# EAGLE design MusselTracker2_RevC (EAGLE 7.2.0)
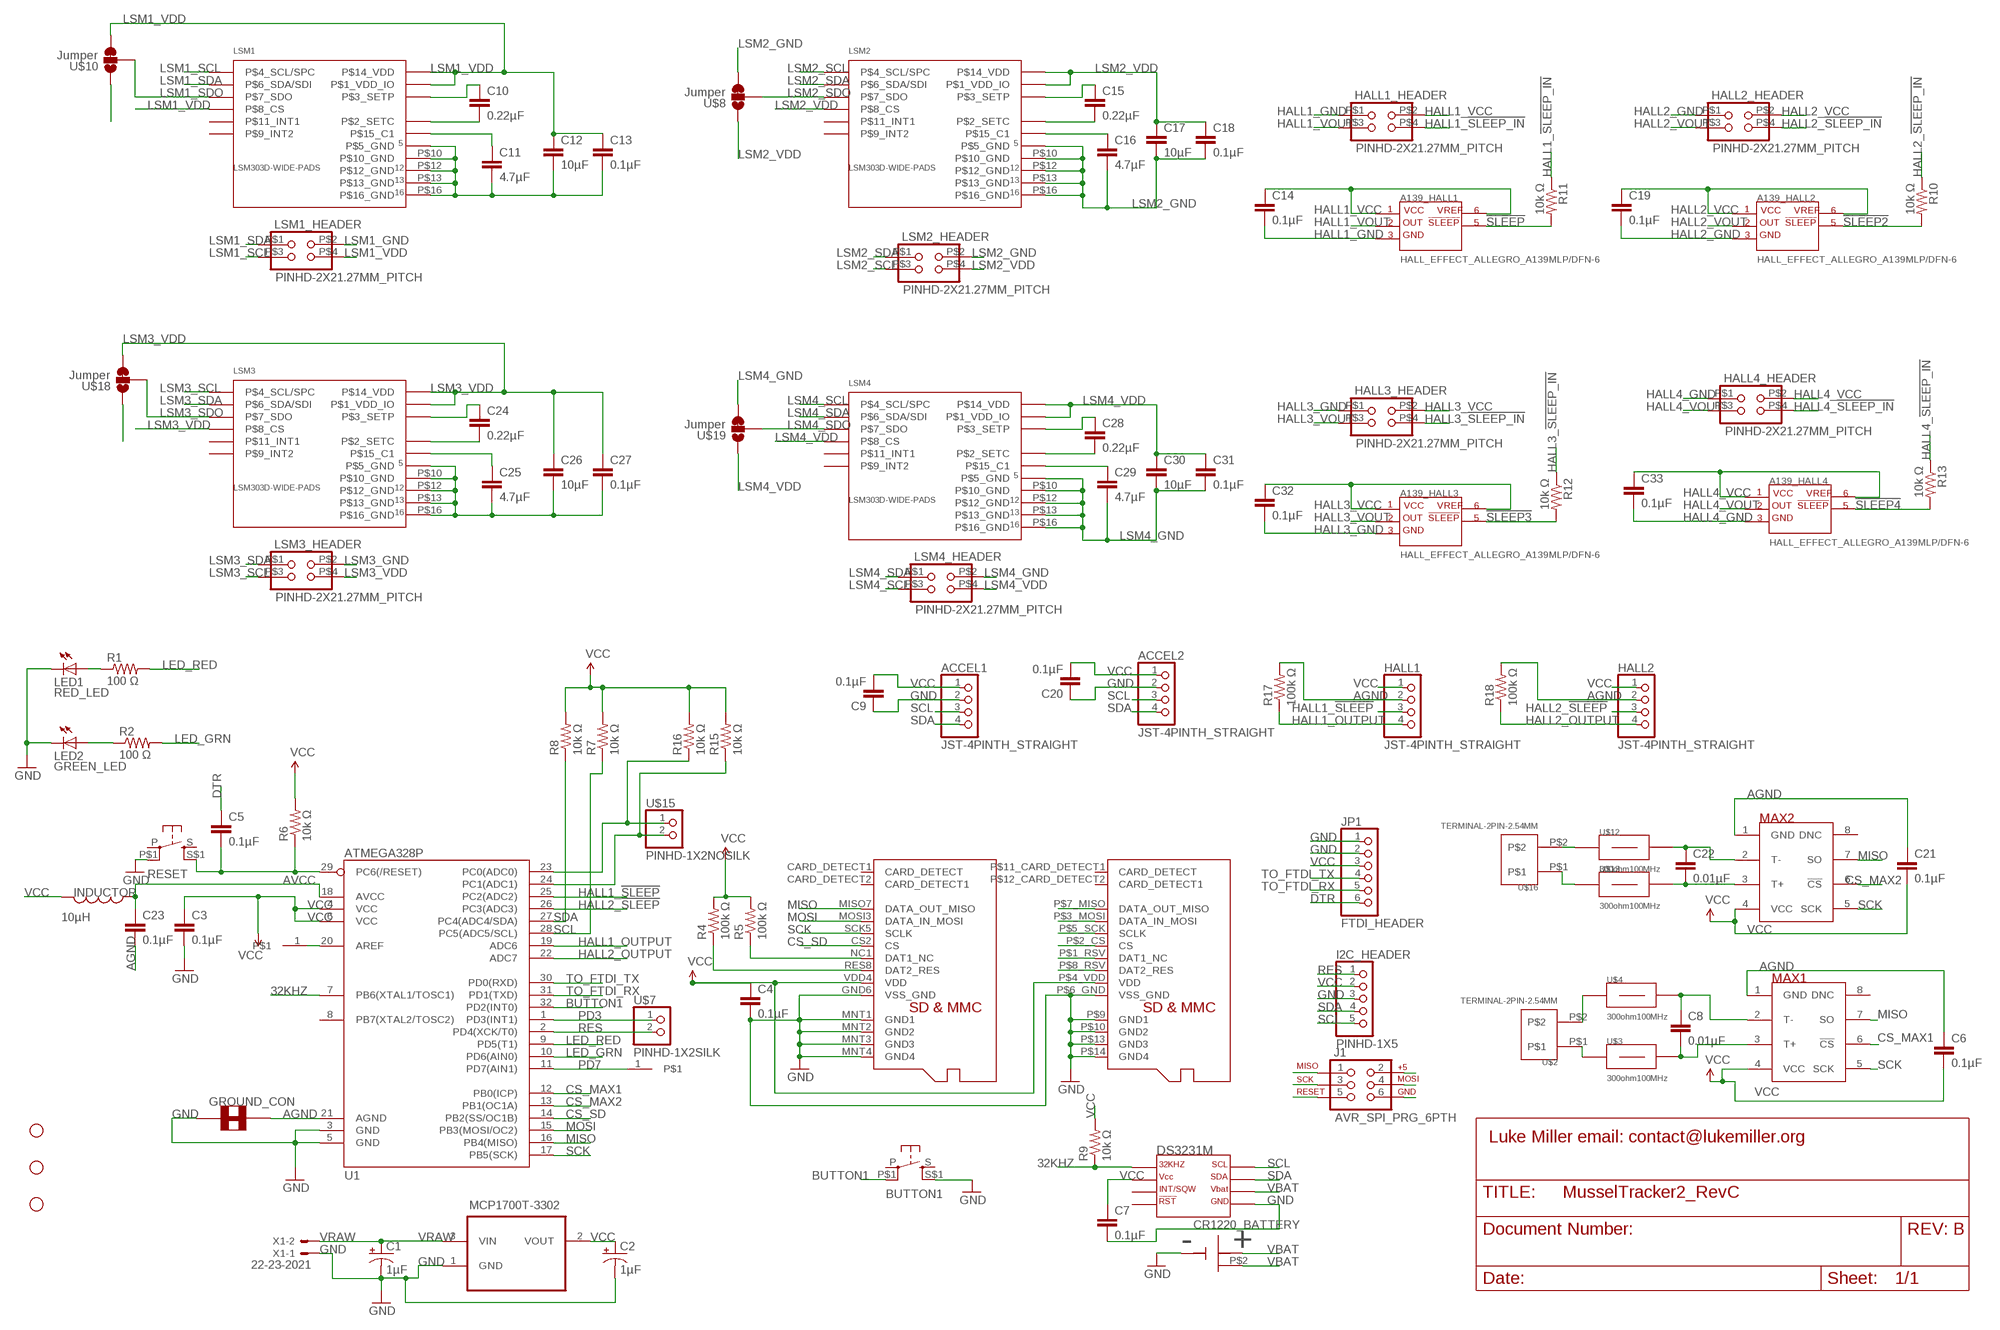
[diagram p0: schematic, sheet 1]

## Parts
A139_HALL1  HALL_EFFECT_ALLEGRO_A139MLP/DFN-6  [A139*_HALL_EFFECT]
A139_HALL2  HALL_EFFECT_ALLEGRO_A139MLP/DFN-6  [A139*_HALL_EFFECT]
A139_HALL3  HALL_EFFECT_ALLEGRO_A139MLP/DFN-6  [A139*_HALL_EFFECT]
A139_HALL4  HALL_EFFECT_ALLEGRO_A139MLP/DFN-6  [A139*_HALL_EFFECT]
ACCEL1  JST-4PINTH_STRAIGHT  [JST-PH-4-THM]
ACCEL2  JST-4PINTH_STRAIGHT  [JST-PH-4-THM]
BUTTON1  PUSHBUTTON_DPST_SMD  [PUSHBUTTON_DPST_SMD]
C1  1µF  CPOL-USB  [PANASONIC_B]
C2  1µF  CPOL-USB  [PANASONIC_B]
C3  0.1µF  CAP0805  [0805]
C4  0.1µF  CAP0805  [0805]
C5  0.1µF  CAP0805  [0805]
C6  0.1µF  CAP0805  [0805]
C7  0.1µF  CAP0805  [0805]
C8  0.01µF  CAP0805_KEMET  [0805_CAP_50V_KEMET]
C9  0.1µF  CAP0805  [0805]
C10  0.22µF  CAP0805  [0805]
C11  4.7µF  CAP0805  [0805]
C12  10µF  CAP0805  [0805]
C13  0.1µF  CAP0805  [0805]
C14  0.1µF  CAP0805  [0805]
C15  0.22µF  CAP0805  [0805]
C16  4.7µF  CAP0805  [0805]
C17  10µF  CAP0805  [0805]
C18  0.1µF  CAP0805  [0805]
C19  0.1µF  CAP0805  [0805]
C20  0.1µF  CAP0805  [0805]
C21  0.1µF  CAP0805  [0805]
C22  0.01µF  CAP0805_KEMET  [0805_CAP_50V_KEMET]
C23  0.1µF  CAP0805  [0805]
C24  0.22µF  CAP0805  [0805]
C25  4.7µF  CAP0805  [0805]
C26  10µF  CAP0805  [0805]
C27  0.1µF  CAP0805  [0805]
C28  0.22µF  CAP0805  [0805]
C29  4.7µF  CAP0805  [0805]
C30  10µF  CAP0805  [0805]
C31  0.1µF  CAP0805  [0805]
C32  0.1µF  CAP0805  [0805]
C33  0.1µF  CAP0805  [0805]
CR1220_BATTERY  CR1220_BATTERY_HOLDERSMD  [CR1220_BATTERY_HOLDER_SMD]
DS3231M  DS3231MSOIC-8  [DS3231M_SOIC8]
GROUND_CON  SOLDER_JUMPER_TRACESTANDARD  [SJ_2S-TRACE]
HALL1  JST-4PINTH_STRAIGHT  [JST-PH-4-THM]
HALL1_HEADER  PINHD-2X21.27MM_PITCH  [2X2_1.27MM]
HALL2  JST-4PINTH_STRAIGHT  [JST-PH-4-THM]
HALL2_HEADER  PINHD-2X21.27MM_PITCH  [2X2_1.27MM]
HALL3_HEADER  PINHD-2X21.27MM_PITCH  [2X2_1.27MM]
HALL4_HEADER  PINHD-2X21.27MM_PITCH  [2X2_1.27MM]
I2C_HEADER  PINHD-1X5  [1X05_BIGLOCK]
INDUCTOR  10µH  INDUCTOR0805_TY  [I_0805]
J1  AVR_SPI_PRG_6PTH  [2X3]
JP1  FTDI_HEADER  PINHD-1X6LOCK  [1X06-BIGLOCK]
LED1  RED_LED  LED0805  [CHIPLED_0805]
LED2  GREEN_LED  LED0805  [CHIPLED_0805]
LSM1  LSM303D-WIDE-PADS  [LSM303D]
LSM1_HEADER  PINHD-2X21.27MM_PITCH  [2X2_1.27MM]
LSM2  LSM303D-WIDE-PADS  [LSM303D]
LSM2_HEADER  PINHD-2X21.27MM_PITCH  [2X2_1.27MM]
LSM3  LSM303D-WIDE-PADS  [LSM303D]
LSM3_HEADER  PINHD-2X21.27MM_PITCH  [2X2_1.27MM]
LSM4  LSM303D-WIDE-PADS  [LSM303D]
LSM4_HEADER  PINHD-2X21.27MM_PITCH  [2X2_1.27MM]
MAX1  MAX31855  [SO08]
MAX2  MAX31855  [SO08]
MCP1700T-3302  MCP1700T-3302E/TT  [SOT95P237X112-3N]
R1  100 Ω  RESISTOR_SMDR0805  [R0805]
R2  100 Ω  RESISTOR_SMDR0805  [R0805]
R4  100k Ω  RESISTOR_SMDR0805  [R0805]
R5  100k Ω  RESISTOR_SMDR0805  [R0805]
R6  10k Ω  RESISTOR_SMDR0805  [R0805]
R7  10k Ω  RESISTOR_SMDR0805  [R0805]
R8  10k Ω  RESISTOR_SMDR0805  [R0805]
R9  10k Ω  RESISTOR_SMDR0805  [R0805]
R10  10k Ω  RESISTOR_SMDR0805  [R0805]
R11  10k Ω  RESISTOR_SMDR0805  [R0805]
R12  10k Ω  RESISTOR_SMDR0805  [R0805]
R13  10k Ω  RESISTOR_SMDR0805  [R0805]
R15  10k Ω  RESISTOR_SMDR0805  [R0805]
R16  10k Ω  RESISTOR_SMDR0805  [R0805]
R17  100k Ω  RESISTOR_SMDR0805  [R0805]
R18  100k Ω  RESISTOR_SMDR0805  [R0805]
RESET  PUSHBUTTON_DPST_SMD  [PUSHBUTTON_DPST_SMD]
STANDOFF1  STAND-OFF  [STAND-OFF]
STANDOFF2  STAND-OFF  [STAND-OFF]
STANDOFF3  STAND-OFF  [STAND-OFF]
U1  ATMEGA328P  ATMEGA328_SMT  [TQFP32-08]
U$1  MICROSD_MOLEX_REVERSECURRENT  [MICROSD_SOCKET_MOLEX_REVERSEMOUNT]
U$2  TERMINAL-2PIN-2.54MM  [TERMINAL-2PIN-2.54MM]
U$3  300ohm100MHz  FERRITE_BEAD0805  [0805]
U$4  300ohm100MHz  FERRITE_BEAD0805  [0805]
U$6  PINHD-1X1SMALL  [1X01_SMALL]
U$7  PINHD-1X2SILK  [1X02]
U$8  Jumper  SOLDER_JUMPER_3_2OF3_NORMALLY_CLOSED_BY_TRACESMALL  [PAD-JUMPER-3-2OF3_NC_BY_TRACE_SMALL]
U$10  Jumper  SOLDER_JUMPER_3_2OF3_NORMALLY_CLOSED_BY_TRACESMALL  [PAD-JUMPER-3-2OF3_NC_BY_TRACE_SMALL]
U$12  300ohm100MHz  FERRITE_BEAD0805  [0805]
U$13  300ohm100MHz  FERRITE_BEAD0805  [0805]
U$14  MICROSD_MOLEX_REVERSEOBSOLETE  [MICROSD_SOCKET_MOLEX_REVERSEMOUNT_OBSOLETE]
U$15  PINHD-1X2NOSILK  [1X02_NOSILK]
U$16  TERMINAL-2PIN-2.54MM  [TERMINAL-2PIN-2.54MM]
U$17  PINHD-1X1SMALL  [1X01_SMALL]
U$18  Jumper  SOLDER_JUMPER_3_2OF3_NORMALLY_CLOSED_BY_TRACESMALL  [PAD-JUMPER-3-2OF3_NC_BY_TRACE_SMALL]
U$19  Jumper  SOLDER_JUMPER_3_2OF3_NORMALLY_CLOSED_BY_TRACESMALL  [PAD-JUMPER-3-2OF3_NC_BY_TRACE_SMALL]
X1  22-23-2021  [22-23-2021]

## Nets
32KHZ: DS3231M.1(P$1_32KHZ) R9.1 U1.7(PB6(XTAL1/TOSC1))
!SLEEP: A139_HALL1.P$5 R11.2
!SLEEP2: A139_HALL2.P$5 R10.2
!SLEEP3: A139_HALL3.P$5 R12.2
!SLEEP4: A139_HALL4.P$5 R13.2
AGND: C6.1 C21.1 C23.2 GROUND_CON.2 HALL1.2 HALL2.2 MAX1.1(GND) MAX2.1(GND) R17.2 R18.2 U1.21(AGND)
AVCC: C23.1 INDUCTOR.P$1 U1.18(AVCC)
BUTTON1: BUTTON1.P$1(P1) U1.32(PD2(INT0))
CS_MAX1: MAX1.6(!CS) U1.12(PB0(ICP))
CS_MAX2: MAX2.6(!CS) U1.13(PB1(OC1A))
CS_SD: U1.14(PB2(SS/OC1B)) U$1.CS2(CS) U$14.P$2_CS(CS)
DTR: C5.1 JP1.6
GND: ACCEL1.2 ACCEL2.2 BUTTON1.S$1(S1) C1.- C2.- C3.2 C4.2 C7.2 C9.1 C20.1 CR1220_BATTERY.GND DS3231M.5(P$5_GND) GROUND_CON.1 I2C_HEADER.3 J1.6 JP1.1 JP1.2 LED1.C LED2.C MCP1700T-3302.1(GND) RESET.P$1(P1) U1.3(GND) U1.5(GND) U$1.GND6(VSS_GND) U$1.MNT1(GND1) U$1.MNT2(GND2) U$1.MNT3(GND3) U$1.MNT4(GND4) U$14.P$6_GND(VSS_GND) U$14.P$9(GND1) U$14.P$10(GND2) U$14.P$13(GND3) U$14.P$14(GND4) X1.1
HALL1_!SLEEP: HALL1.3 U1.25(PC2(ADC2))
HALL1_!SLEEP_IN: HALL1_HEADER.P$4 R11.1
HALL1_GND: A139_HALL1.P$3_4 C14.2 HALL1_HEADER.P$1
HALL1_OUTPUT: HALL1.4 R17.1 U1.19(ADC6)
HALL1_VCC: A139_HALL1.P$1 A139_HALL1.P$6 C14.1 HALL1_HEADER.P$2
HALL1_VOUT: A139_HALL1.P$2 HALL1_HEADER.P$3
HALL2_!SLEEP: HALL2.3 U1.26(PC3(ADC3))
HALL2_!SLEEP_IN: HALL2_HEADER.P$4 R10.1
HALL2_GND: A139_HALL2.P$3_4 C19.2 HALL2_HEADER.P$1
HALL2_OUTPUT: HALL2.4 R18.1 U1.22(ADC7)
HALL2_VCC: A139_HALL2.P$1 A139_HALL2.P$6 C19.1 HALL2_HEADER.P$2
HALL2_VOUT: A139_HALL2.P$2 HALL2_HEADER.P$3
HALL3_!SLEEP_IN: HALL3_HEADER.P$4 R12.1
HALL3_GND: A139_HALL3.P$3_4 C32.2 HALL3_HEADER.P$1
HALL3_VCC: A139_HALL3.P$1 A139_HALL3.P$6 C32.1 HALL3_HEADER.P$2
HALL3_VOUT: A139_HALL3.P$2 HALL3_HEADER.P$3
HALL4_!SLEEP_IN: HALL4_HEADER.P$4 R13.1
HALL4_GND: A139_HALL4.P$3_4 C33.2 HALL4_HEADER.P$1
HALL4_VCC: A139_HALL4.P$1 A139_HALL4.P$6 C33.1 HALL4_HEADER.P$2
HALL4_VOUT: A139_HALL4.P$2 HALL4_HEADER.P$3
LED_GRN: R2.2 U1.10(PD6(AIN0))
LED_RED: R1.2 U1.9(PD5(T1))
LSM1_GND: C11.2 C12.2 C13.2 LSM1.P$5(P$5_GND) LSM1.P$10(P$10_GND) LSM1.P$12(P$12_GND) LSM1.P$13(P$13_GND) LSM1.P$16(P$16_GND) LSM1_HEADER.P$2 U$10.1
LSM1_SCL: LSM1.P$4(P$4_SCL/SPC) LSM1_HEADER.P$3
LSM1_SDA: LSM1.P$6(P$6_SDA/SDI) LSM1_HEADER.P$1
LSM1_SDO: LSM1.P$7(P$7_SDO) U$10.2
LSM1_VDD: C12.1 C13.1 LSM1.P$1(P$1_VDD_IO) LSM1.P$8(P$8_CS) LSM1.P$14(P$14_VDD) LSM1_HEADER.P$4 U$10.3
LSM2_GND: C16.2 C17.2 C18.2 LSM2.P$5(P$5_GND) LSM2.P$10(P$10_GND) LSM2.P$12(P$12_GND) LSM2.P$13(P$13_GND) LSM2.P$16(P$16_GND) LSM2_HEADER.P$2 U$8.3
LSM2_SCL: LSM2.P$4(P$4_SCL/SPC) LSM2_HEADER.P$3
LSM2_SDA: LSM2.P$6(P$6_SDA/SDI) LSM2_HEADER.P$1
LSM2_SDO: LSM2.P$7(P$7_SDO) U$8.2
LSM2_VDD: C17.1 C18.1 LSM2.P$1(P$1_VDD_IO) LSM2.P$8(P$8_CS) LSM2.P$14(P$14_VDD) LSM2_HEADER.P$4 U$8.1
LSM3_GND: C25.2 C26.2 C27.2 LSM3.P$5(P$5_GND) LSM3.P$10(P$10_GND) LSM3.P$12(P$12_GND) LSM3.P$13(P$13_GND) LSM3.P$16(P$16_GND) LSM3_HEADER.P$2 U$18.1
LSM3_SCL: LSM3.P$4(P$4_SCL/SPC) LSM3_HEADER.P$3
LSM3_SDA: LSM3.P$6(P$6_SDA/SDI) LSM3_HEADER.P$1
LSM3_SDO: LSM3.P$7(P$7_SDO) U$18.2
LSM3_VDD: C26.1 C27.1 LSM3.P$1(P$1_VDD_IO) LSM3.P$8(P$8_CS) LSM3.P$14(P$14_VDD) LSM3_HEADER.P$4 U$18.3
LSM4_GND: C29.2 C30.2 C31.2 LSM4.P$5(P$5_GND) LSM4.P$10(P$10_GND) LSM4.P$12(P$12_GND) LSM4.P$13(P$13_GND) LSM4.P$16(P$16_GND) LSM4_HEADER.P$2 U$19.3
LSM4_SCL: LSM4.P$4(P$4_SCL/SPC) LSM4_HEADER.P$3
LSM4_SDA: LSM4.P$6(P$6_SDA/SDI) LSM4_HEADER.P$1
LSM4_SDO: LSM4.P$7(P$7_SDO) U$19.2
LSM4_VDD: C30.1 C31.1 LSM4.P$1(P$1_VDD_IO) LSM4.P$8(P$8_CS) LSM4.P$14(P$14_VDD) LSM4_HEADER.P$4 U$19.1
MISO: J1.1 MAX1.7(SO) MAX2.7(SO) U1.16(PB4(MISO)) U$1.MISO7(DATA_OUT_MISO) U$14.P$7_MISO(DATA_OUT_MISO)
MOSI: J1.4 U1.15(PB3(MOSI/OC2)) U$1.MOSI3(DATA_IN_MOSI) U$14.P$3_MOSI(DATA_IN_MOSI)
N$1: U$2.P$2 U$4.1
N$2: LED1.A R1.1
N$3: U$2.P$1 U$3.1
N$4: C11.1 LSM1.P$15(P$15_C1)
N$5: C10.2 LSM1.P$2(P$2_SETC)
N$6: R16.1 U1.23(PC0(ADC0)) U$15.1
N$7: U1.20(AREF) U$17.1
N$9: R15.1 U1.24(PC1(ADC1)) U$15.2
N$10: LED2.A R2.1
N$11: U$12.1 U$16.P$2
N$12: U$13.1 U$16.P$1
N$14: C24.2 LSM3.P$2(P$2_SETC)
N$15: C24.1 LSM3.P$3(P$3_SETP)
N$17: C10.1 LSM1.P$3(P$3_SETP)
N$18: C15.2 LSM2.P$2(P$2_SETC)
N$19: C15.1 LSM2.P$3(P$3_SETP)
N$20: C16.1 LSM2.P$15(P$15_C1)
N$21: C25.1 LSM3.P$15(P$15_C1)
N$22: C28.1 LSM4.P$3(P$3_SETP)
N$23: C28.2 LSM4.P$2(P$2_SETC)
N$24: C29.1 LSM4.P$15(P$15_C1)
NC1: R5.1 U$1.NC1(DAT1_NC) U$14.P$1_RSV(DAT1_NC)
PD3: U1.1(PD3(INT1)) U$7.1
PD7: U1.11(PD7(AIN1)) U$6.1
RES: I2C_HEADER.1 U1.2(PD4(XCK/T0)) U$7.2
RES8: R4.1 U$1.RES8(DAT2_RES) U$14.P$8_RSV(DAT2_RES)
RESET: C5.2 J1.5 R6.1 RESET.S$1(S1) U1.29(PC6(/RESET))
SCK: J1.3 MAX1.5(SCK) MAX2.5(SCK) U1.17(PB5(SCK)) U$1.SCK5(SCLK) U$14.P$5_SCK(SCLK)
SCL: ACCEL1.3 ACCEL2.3 DS3231M.8(P$8_SCL) I2C_HEADER.5 R7.1 U1.28(PC5(ADC5/SCL))
SDA: ACCEL1.4 ACCEL2.4 DS3231M.7(P$7_SDA) I2C_HEADER.4 R8.1 U1.27(PC4(ADC4/SDA))
T+_MAX1: C8.2 MAX1.3(T+) U$3.2
T+_MAX2: C22.2 MAX2.3(T+) U$13.2
T-_MAX1: C8.1 MAX1.2(T-) U$4.2
T-_MAX2: C22.1 MAX2.2(T-) U$12.2
TO_FTDI_RX: JP1.5 U1.31(PD1(TXD))
TO_FTDI_TX: JP1.4 U1.30(PD0(RXD))
VBAT: CR1220_BATTERY.P$1(VBAT) CR1220_BATTERY.P$2 DS3231M.6(P$6_VBAT)
VCC: ACCEL1.1 ACCEL2.1 C2.+ C3.1 C4.1 C6.2 C7.1 C9.2 C20.2 C21.2 DS3231M.2(P$2_VCC) HALL1.1 HALL2.1 I2C_HEADER.2 INDUCTOR.P$2 J1.2 JP1.3 MAX1.4(VCC) MAX2.4(VCC) MCP1700T-3302.2(VOUT) R4.2 R5.2 R6.2 R7.2 R8.2 R9.2 R15.2 R16.2 U1.4(VCC) U1.6(VCC) U$1.VDD4(VDD) U$14.P$4_VDD(VDD)
VRAW: C1.+ MCP1700T-3302.3(VIN) X1.2
Unconnected: BUTTON1.P BUTTON1.S DS3231M.3(P$3_INT) DS3231M.4(P$4_RST) LSM1.P$9(P$9_INT2) LSM1.P$11(P$11_INT1) LSM2.P$9(P$9_INT2) LSM2.P$11(P$11_INT1) LSM3.P$9(P$9_INT2) LSM3.P$11(P$11_INT1) LSM4.P$9(P$9_INT2) LSM4.P$11(P$11_INT1) MAX1.8(DNC) MAX2.8(DNC) RESET.P RESET.S U1.8(PB7(XTAL2/TOSC2)) U$1.CARD_DETECT1(CARD_DETECT) U$1.CARD_DETECT2(CARD_DETECT1) U$14.P$11_CARD_DETECT1(CARD_DETECT) U$14.P$12_CARD_DETECT2(CARD_DETECT1)

## Library data of the parts
A139_HALL1-A139_HALL4 = miller:HALL_EFFECT_ALLEGRO_A139*: Allegro A139* series Hall effect sensors A1391 1.25mV/Gauss A1392 2.5 mV/G A1393 5 mV/G A1395 10 mV/G Example Digikey PN 620-1031-1-ND (A1391SE)
ACCEL1 ACCEL2 HALL1 HALL2 = miller:JST-4PIN: JST PH series male header pins 2.0 mm pitch Example JST PN: B4B-PH-K-S(LF)(SN) Example Digikey PN: 455-1706-ND Mates with JST PN: PHR-4, Digikey PN: 455-1164-ND
BUTTON1 RESET = miller:PUSHBUTTON_DPST_SMD: PUSHBUTTON DPST SMD Omron B3S-1000 Digikey PN SW836CT-ND This is your standard "hobbyist" style momentary pushbutton in a surface mount package.
C1 C2 = miller:CPOL-US: POLARIZED CAPACITOR, American symbol
C3-C33 = miller:CAP: Capacitor Standard surface mount ceramic capacitor and 0.1" leaded capacitor.
CR1220_BATTERY = miller:CR1220_BATTERY_HOLDER: CR1220 Battery Holder Keystone Part # 3001 Digikey 3001K-ND
DS3231M = miller:DS3231M: DS3231M real time clock Battery backup, 2.3V to 5.5V supply voltage 1Hz and 32.768kHz outputs NOTE: This is a slightly lower cost version of the regular DS3231S, with fewer clock frequency output options and slightly lower long-term time accuracy. It uses the same I2C communications protocol as the DS3231S, and is available in a small SOIC-8 package or Wide SOIC-16 (0.300") package. Maxim PN DS3231MZ+ SOIC-8 package Maxim PN DS3231M+ SOIC-16 Wide package
GROUND_CON = miller:SOLDER_JUMPER_TRACE: Solder jumper with trace Treat this like a zero ohm resistor. The trace can be cut with a knife.
HALL1_HEADER HALL2_HEADER HALL3_HEADER HALL4_HEADER LSM1_HEADER LSM2_HEADER LSM3_HEADER LSM4_HEADER = miller:PINHD-2X2: 2x2 header Various pitches
I2C_HEADER = miller:PINHD-1X5: 1 x 5 header 0.1" spacing Slightly offset holes to help hold pins in place when soldering
INDUCTOR = Felicia_force_logger:INDUCTOR: Inductor Example: Taiyo Yuden PN LBR2012T100K
J1 = miller:AVR_SPI_PRG_6: AVR ISP 6 Pin This is the reduced ISP connector for AVR programming. Common on Arduino. This footprint will take up less PCB space and can be used with a 10-pin to 6-pin adapter such as SKU: BOB-08508 **Special note about "TEST_POINT" package. The stop mask is on the top side, so if you want your programming test points to be on the bottom of your board, make sure to place this package on the bottom side of the board. This also ensure that the orientation to program from the bottom side will be correct.
JP1 = miller:PINHD-1X6: PIN HEADER
LED1 LED2 = miller:LED: LEDs Standard schematic elements and footprints for 5mm, 3mm, 1206, and 0603 sized LEDs. 5mm - Spark Fun Electronics SKU : COM-00529 (and others)
LSM1-LSM4 = miller:LSM303D-WIDE-PADS: LSM303D magnetometer and accelerometer LGA-16 package with extra-wide pads
MAX1 MAX2 = miller:MAX31855: MAX31855 Thermocouple amplifier with cold junction compensation, SPI communication Maxim-ic PN MAX31855 (thermocouple code is appended at end of PN) Digikey PN MAX31855K, MAX31855T, MAX31855J etc. Surface mount, 8-SOIC Narrow, 3.0 to 3.6V supply
MCP1700T-3302 = miller:MCP1700T-3302E/TT: Low Quiescent Current LDO 3.3V Microchip Technology PN MCP1700T-3302E Digikey PN MCP1700T3302ETTCT-ND; MPN: MCP1700T-3302E/TT; OC_FARNELL: 1296592; OC_NEWARK: 88H9817; PACKAGE: SOT23-3; SUPPLIER: Microchip
R1 R2 R4-R13 R15-R18 = miller:RESISTOR_SMD: RESISTOR, American symbol
STANDOFF1-STANDOFF3 = miller:STAND-OFF: #4 Stand Off This is the mechanical footprint for a #4 phillips button head screw. Use the keepout ring to avoid running the screw head into surrounding components. SKU : PRT-00447
U1 = miller:ATMEGA328_SMT: 32-Pin Atmega328
U$1 U$14 = miller:MICROSD_MOLEX_REVERSE: Molex micro SD connector, push-push spring loaded, "reverse" mount Pins accessible at rear of case. Active: Molex PN 5027740891 Digikey PN WM24066CT-ND Obsolete: Molex PN 49225-201
U$2 U$16 = miller:TERMINAL-2PIN-2.54MM: Terminal block 0.1" spacing Example: On Shore Technology PN OSTVN02A150 Digikey PN ED10561-ND
U$3 U$4 U$12 U$13 = miller:FERRITE_BEAD: Ferrite bead Example: TDK Corp PN MMZ2012R301AT000, Digikey PN 445-2191-1-ND
U$6 U$17 = miller:PINHD-1X1: Just a single pin header, useful for making test point or stand-alone header hole. The small footprint is 0.035" diameter, barely large enough for standard 0.1" pitch header pins.
U$7 U$15 = miller:PINHD-1X2: 1x2 pin header 0.1" spacing (2.54mm)
U$8 U$10 U$18 U$19 = miller:SOLDER_JUMPER_3_2OF3_NORMALLY_CLOSED_BY_TRACE: Solder jumper pads, 3 position, 2 normally closed by trace Cut trace with a razor and bridge pads with solder if needed.
X1 = miller:22-23-2021: Molex KK series .100" (2.54mm) Center Header - 2 Pin; MF: MOLEX; MPN: 22-23-2021; OC_FARNELL: 1462926; OC_NEWARK: 25C3832

## Board
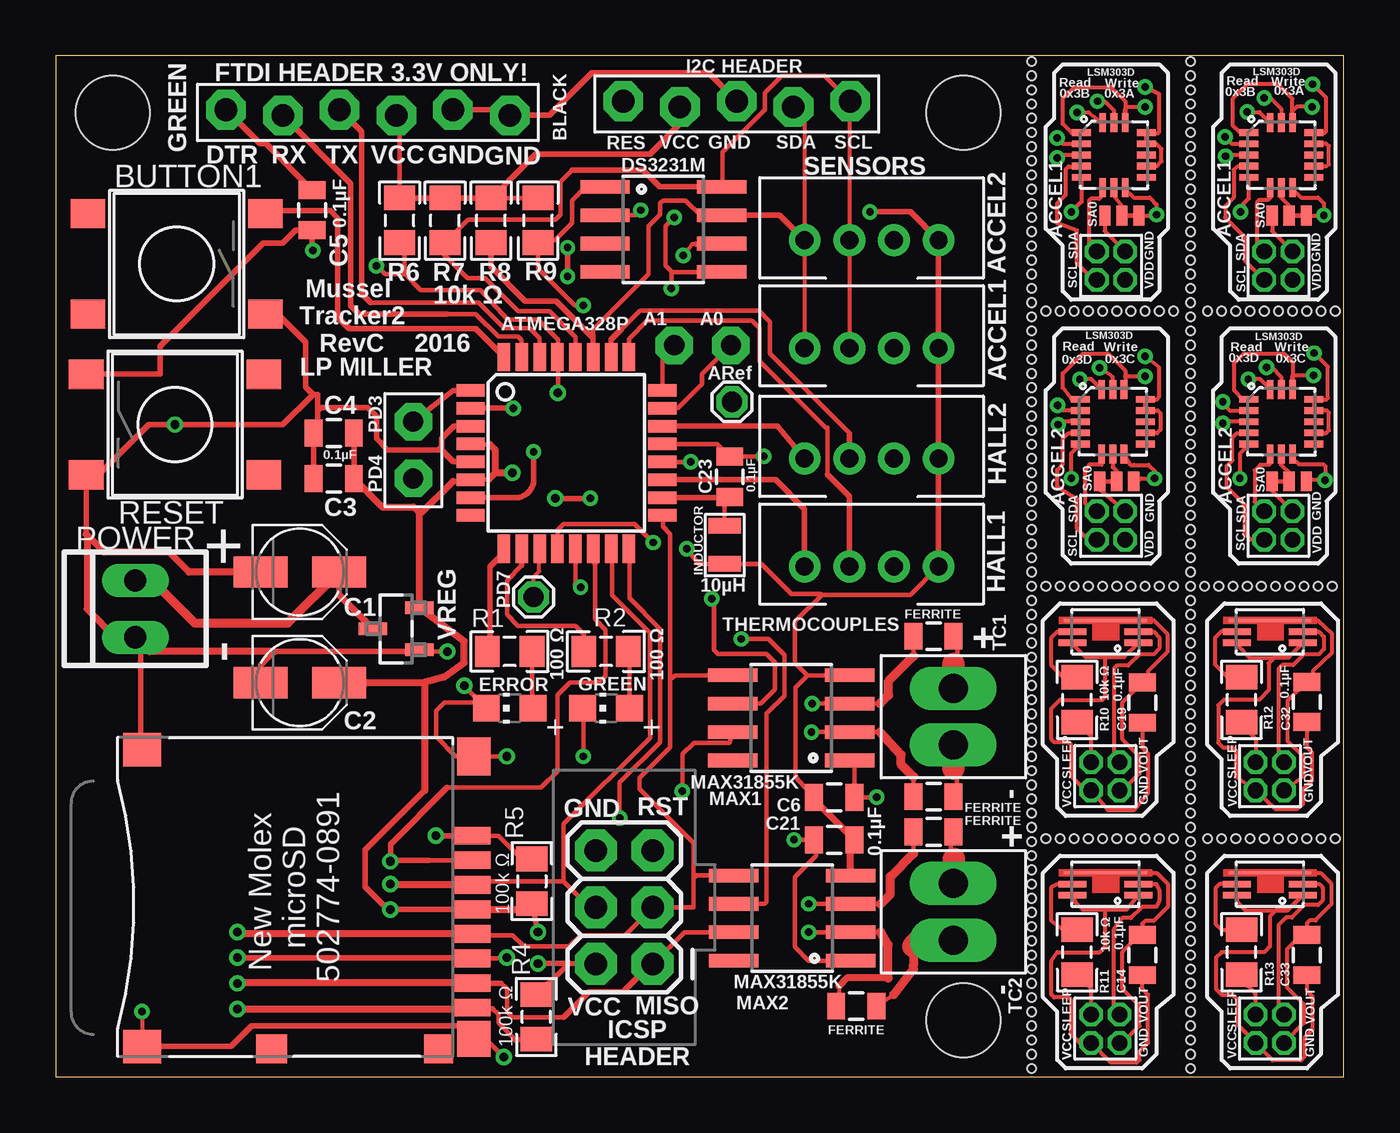
[diagram p1: board, top side]
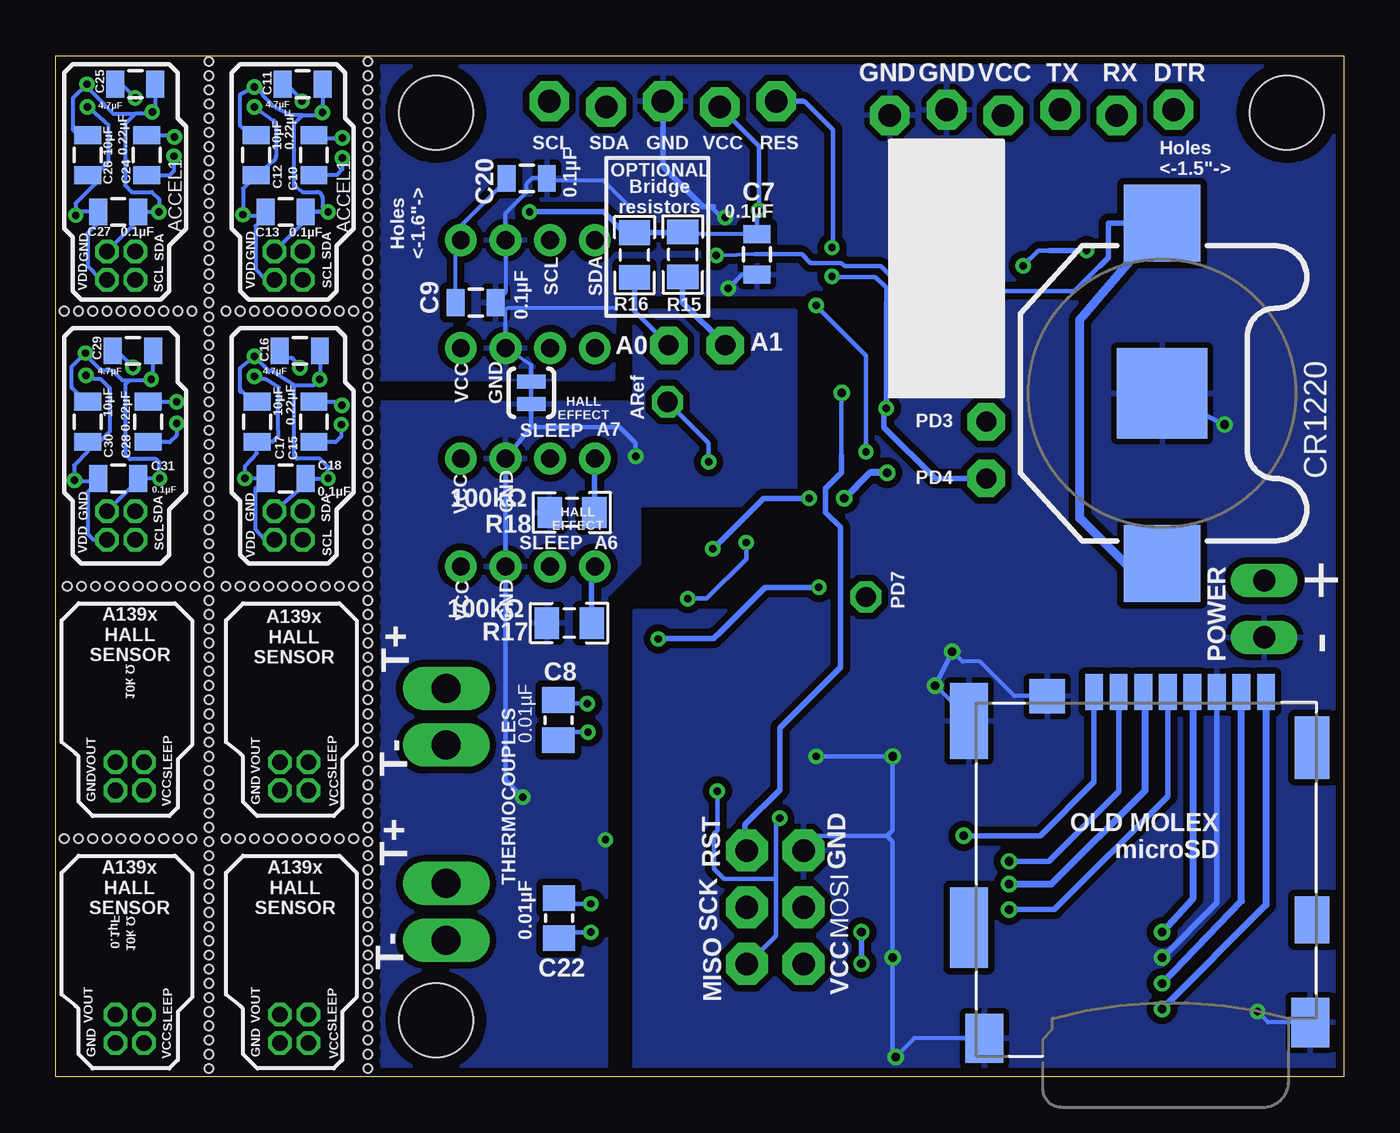
[diagram p2: board, bottom side, seen from below]

Size 57.66 x 45.72 mm. Coordinates in mm from the lower left corner, seen from the top.
Outline: 0,0 57.66,0 57.66,45.72 0,45.72 0,0
Copper layers (1*16): Top 0.0356mm / dielectric 1.5011mm / Bottom 0.0356mm
Design rules "LaenPCBOrder *": minimum track width 6mil, minimum drill 13mil, track to track 6mil, track to pad 6mil, pad to pad 6mil, via to via 6mil, smd to smd 6mil, copper to edge 15mil, drill to drill 6mil, minimum pad ring 7mil, minimum via ring 7mil, stop-mask expansion 3mil, vias tented up to drill 30mil, thermal gap 10mil
Holes 0.38 mm at 43.69,0.38 43.69,1.02 43.69,1.65 43.69,2.29 43.69,2.92 43.69,3.56 43.69,4.19 43.69,4.83 43.69,5.46 43.69,6.1 43.69,6.73 43.69,7.37 43.69,8 43.69,8.64 43.69,9.27 43.69,9.91 43.69,10.54 43.69,11.18 43.69,11.81 43.69,12.45 43.69,13.08 43.69,13.72 43.69,14.35 43.69,14.99 43.69,15.62 43.69,16.26 43.69,16.89 43.69,17.53 43.69,18.16 43.69,18.8 43.69,19.43 43.69,20.07 43.69,20.7 43.69,21.34 43.69,21.97 43.69,22.61 43.69,23.24 43.69,23.88 43.69,24.51 43.69,25.15 43.69,25.78 43.69,26.42 43.69,27.05 43.69,27.69 43.69,28.32 43.69,28.96 43.69,29.59 43.69,30.23 43.69,30.86 43.69,31.5 43.69,32.13 43.69,32.77 43.69,33.4 43.69,34.04 43.69,34.67 43.69,35.31 43.69,35.94 43.69,36.58 43.69,37.21 43.69,37.85 43.69,38.48 43.69,39.12 43.69,39.75 43.69,40.39 43.69,41.02 43.69,41.66 43.69,42.29 43.69,42.93 43.69,43.56 43.69,44.2 43.69,44.83 43.69,45.47 50.04,34.29 49.4,34.29 48.77,34.29 48.13,34.29 47.5,34.29 46.86,34.29 46.23,34.29 45.59,34.29 44.96,34.29 44.32,34.29 44.32,10.67 44.96,10.67 45.59,10.67 46.23,10.67 46.86,10.67 47.5,10.67 48.13,10.67 48.77,10.67 44.32,21.97 44.96,21.97 45.59,21.97 46.23,21.97 46.86,21.97 47.5,21.97 48.13,21.97 48.77,21.97 49.4,21.97 50.04,21.97 49.4,10.67 50.04,10.67 50.8,0.38 50.8,1.02 50.8,1.65 50.8,2.29 50.8,2.92 50.8,3.56 50.8,4.19 50.8,4.83 50.8,5.46 50.8,6.1 50.8,6.73 50.8,7.37 50.8,8 50.8,8.64 50.8,9.27 50.8,9.91 50.8,10.54 50.8,11.18 50.8,11.81 50.8,12.45 50.8,13.08 50.8,13.72 50.8,14.35 50.8,14.99 50.8,15.62 50.8,16.26 50.8,16.89 50.8,17.53 50.8,18.16 50.8,18.8 50.8,19.43 50.8,20.07 50.8,20.7 50.8,21.34 50.8,21.97 50.8,22.61 50.8,23.24 50.8,23.88 50.8,24.51 50.8,25.15 50.8,25.78 50.8,26.42 50.8,27.05 50.8,27.69 50.8,28.32 50.8,28.96 50.8,29.59 50.8,30.23 50.8,30.86 50.8,31.5 50.8,32.13 50.8,32.77 50.8,33.4 50.8,34.04 50.8,34.67 50.8,35.31 50.8,35.94 50.8,36.58 50.8,37.21 50.8,37.85 50.8,38.48 50.8,39.12 50.8,39.75 50.8,40.39 50.8,41.02 50.8,41.66 50.8,42.29 50.8,42.93 50.8,43.56 50.8,44.2 50.8,44.83 50.8,45.47 51.56,10.67 52.2,10.67 52.83,10.67 53.47,10.67 54.1,10.67 54.74,10.67 55.37,10.67 56.01,10.67 56.64,10.67 57.28,10.67 51.44,21.97 52.07,21.97 52.7,21.97 53.34,21.97 53.98,21.97 54.61,21.97 55.24,21.97 55.88,21.97 56.52,21.97 57.15,21.97 57.28,34.29 56.64,34.29 56.01,34.29 55.37,34.29 54.74,34.29 54.1,34.29 53.47,34.29 52.83,34.29 52.2,34.29 51.56,34.29
tRestrict: area 46.5,40.4 to 48.3,42.2; area 46.5,28.4 to 48.3,30.2

### Footprints (pad centres in the part's own frame; a part is rotated, then mirrored left to right if it is on the bottom)
A139*_HALL_EFFECT = smd 0.3 x 1.25: P$1 -0.5,-1.475; P$2 0,-1.475; P$5 0,1.475; P$6 -0.5,1.475 | smd 0.15 x 3.7: P$3_4 0.5,0
JST-PH-4-THM = drill 0.8 pad 1.422: 1 3,0; 2 1,0; 3 -1,0; 4 -3,0
PUSHBUTTON_DPST_SMD = smd 1.55 x 1.3: P 3.975,-2.25; P$1 -3.975,-2.25; S 3.975,2.25; S$1 -3.975,2.25
PANASONIC_B = smd 2.413 x 1.4: + 1.752,0; - -1.752,0
0805 = smd 0.8 x 1.2: 1 -0.9,0; 2 0.9,0
0805_CAP_50V_KEMET = smd 1.15 x 1.45: 1 -0.9,0; 2 0.9,0
CR1220_BATTERY_HOLDER_SMD = smd 4.064 x 4.064: GND 0,0 | smd 3.429 x 3.429: P$1 -7.62,0; P$2 7.62,0
DS3231M_SOIC8 = smd 0.61 x 2.21: 1 -1.905,-2.616; 2 -0.635,-2.616; 3 0.635,-2.616; 4 1.905,-2.616; 5 1.905,2.616; 6 0.635,2.616; 7 -0.635,2.616; 8 -1.905,2.616
SJ_2S-TRACE = smd 0.635 x 1.27: 1 -0.508,0; 2 0.508,0
2X2_1.27MM = drill 0.7 pad 1.057 octagon: P$1 -0.635,0.635; P$2 0.635,0.635; P$3 -0.635,-0.635; P$4 0.635,-0.635
1X05_BIGLOCK = drill 1.016 pad 1.778 octagon: 1 -6.35,0.127; 2 -3.81,-0.127; 3 -1.27,0.127; 4 1.27,-0.127; 5 3.81,0.127
I_0805 = smd 0.7 x 1.45: P$1 -0.85,0; P$2 0.85,0
2X3 = drill 1.016 pad 1.88 octagon: 1 -2.54,0; 2 -2.54,2.54; 3 0,0; 4 0,2.54; 5 2.54,0; 6 2.54,2.54
1X06-BIGLOCK = drill 1.016 pad 1.778 octagon: 1 -6.35,0.127; 2 -3.81,-0.127; 3 -1.27,0.127; 4 1.27,-0.127; 5 3.81,0.127; 6 6.35,-0.127
CHIPLED_0805 = smd 1.2 x 1.2: A 0,-1.05; C 0,1.05
LSM303D = smd 0.85 x 0.3: P$1 -1.45,1; P$2 -1.45,0.5; P$3 -1.45,0; P$4 -1.45,-0.5; P$5 -1.45,-1; P$10 1.45,-0.5; P$11 1.45,0; P$12 1.45,0.5; P$13 1.45,1 | smd 0.3 x 0.85: P$6 -0.5,-1.45; P$7 0,-1.45; P$8 0.5,-1.45; P$14 0.5,1.45; P$15 0,1.45; P$16 -0.5,1.45 | smd 0.852 x 0.3: P$9 1.45,-1
SO08 = smd 0.61 x 2.21: 1 -1.905,-2.616; 2 -0.635,-2.616; 3 0.635,-2.616; 4 1.905,-2.616; 5 1.905,2.616; 6 0.635,2.616; 7 -0.635,2.616; 8 -1.905,2.616
SOT95P237X112-3N = smd 0.559 x 1.27: 1 -0.94,-1.041; 2 0.94,-1.041; 3 0,1.041
R0805 = smd 1.1 x 1.4: 1 -1,0; 2 1,0
STAND-OFF = hole 3.302: 0,0
TQFP32-08 = smd 1.27 x 0.559: 1 -4.293,2.8; 2 -4.293,2; 3 -4.293,1.2; 4 -4.293,0.4; 5 -4.293,-0.4; 6 -4.293,-1.2; 7 -4.293,-2; 8 -4.293,-2.8; 17 4.293,-2.8; 18 4.293,-2; 19 4.293,-1.2; 20 4.293,-0.4; 21 4.293,0.4; 22 4.293,1.2; 23 4.293,2; 24 4.293,2.8 | smd 0.559 x 1.27: 9 -2.8,-4.293; 10 -2,-4.293; 11 -1.2,-4.293; 12 -0.4,-4.293; 13 0.4,-4.293; 14 1.2,-4.293; 15 2,-4.293; 16 2.8,-4.293; 25 2.8,4.293; 26 2,4.293; 27 1.2,4.293; 28 0.4,4.293; 29 -0.4,4.293; 30 -1.2,4.293; 31 -2,4.293; 32 -2.8,4.293
MICROSD_SOCKET_MOLEX_REVERSEMOUNT = smd 1.29 x 1.4: CARD_DETECT1 -0.645,8.12 | smd 1.29 x 1.3: CARD_DETECT2 -0.645,0.65 | smd 0.8 x 1.68: CS2 7.8,-0.84; GND6 3.4,-0.84; MISO7 2.3,-0.84; MOSI3 6.7,-0.84; NC1 8.9,-0.84; RES8 1.2,-0.84; SCK5 4.5,-0.84; VDD4 5.6,-0.84 | smd 1.6 x 1.5: MNT1 -0.2,-0.93 | smd 1.7 x 1.5: MNT2 12.45,-0.93 | smd 1.5 x 1.7: MNT3 -0.54,13.92; MNT4 12.75,13.92
TERMINAL-2PIN-2.54MM = drill 1.3 pad 1.778 long: P$1 -1.27,0; P$2 1.27,0
1X01_SMALL = drill 0.9 pad 1.397 octagon: 1 0,0
1X02 = drill 0.9 pad 1.676 octagon: 1 -1.27,0; 2 1.27,0
PAD-JUMPER-3-2OF3_NC_BY_TRACE_SMALL = smd 0.508 x 0.889: 1 -0.762,0; 2 0,0; 3 0.762,0
MICROSD_SOCKET_MOLEX_REVERSEMOUNT_OBSOLETE = smd 0.8 x 1.6: P$1_RSV 10.54,-16.6; P$2_CS 9.44,-16.6; P$3_MOSI 8.34,-16.6; P$4_VDD 7.24,-16.6; P$5_SCK 6.14,-16.6; P$6_GND 5.04,-16.6; P$7_MISO 3.94,-16.6; P$8_RSV 2.84,-16.6 | smd 1.6 x 1.55: P$9 12.64,-16.42 | smd 1.7 x 3.4: P$10 16.15,-15.3 | smd 1.55 x 2.8: P$11_CARD_DETECT1 0.775,-14.1 | smd 1.55 x 2.1: P$12_CARD_DETECT2 0.775,-6.4 | smd 1.7 x 2.2: P$13 0.85,-1.8; P$14 15.45,-1.1 | smd 1.7 x 3.6: P$15 16.15,-6.05
1X02_NOSILK = drill 0.9 pad 1.676 octagon: 1 -1.27,0; 2 1.27,0
22-23-2021 = drill 1 long: 1 -1.27,0; 2 1.27,0

### Placement (x,y rotation side)
A139_HALL1  46.99,8.64 90 top
A139_HALL2  46.99,19.94 90 top
A139_HALL3  54.36,19.94 90 top
A139_HALL4  54.36,8.64 90 top
ACCEL1  36.53,32.64 0 top
ACCEL2  36.53,37.47 0 top
BUTTON1  5.41,36.4 180 top
C1  10.92,22.61 0 top
C2  10.92,17.65 0 top
C3  12.45,26.8 180 top
C4  12.45,28.83 180 top
C5  11.48,38.81 270 top
C6  34.85,12.52 180 top
C7  26.26,36.83 270 bottom
C8  35.15,15.98 90 bottom
C9  38.86,34.67 180 bottom
C10  46.1,41.27 90 bottom
C11  46.61,44.45 0 bottom
C12  48.69,41.27 90 bottom
C13  47.37,38.73 0 bottom
C14  48.64,5.46 90 top
C15  46.1,29.34 90 bottom
C16  46.74,32.51 0 bottom
C17  48.64,29.34 90 bottom
C18  47.37,26.8 0 bottom
C19  48.64,16.76 90 top
C20  36.58,40.23 180 bottom
C21  34.85,10.62 0 top
C22  35.13,7.11 90 bottom
C23  30.18,26.87 90 top
C24  53.59,41.27 90 bottom
C25  54.1,44.45 0 bottom
C26  56.24,41.27 90 bottom
C27  54.86,38.73 0 bottom
C28  53.52,29.34 90 bottom
C29  54.2,32.51 0 bottom
C30  56.24,29.34 90 bottom
C31  54.86,26.8 0 bottom
C32  56.01,16.79 90 top
C33  56.01,5.46 90 top
CR1220_BATTERY  8.13,30.61 270 bottom
DS3231M  27.2,37.95 270 top
GROUND_CON  36.37,30.63 270 bottom
HALL1  36.53,22.86 0 top
HALL1_HEADER  46.99,2.16 180 top
HALL2  36.53,27.69 0 top
HALL2_HEADER  46.99,13.46 180 top
HALL3_HEADER  54.36,13.46 180 top
HALL4_HEADER  54.36,2.16 180 top
I2C_HEADER  31.75,43.56 0 top
INDUCTOR  29.95,23.83 270 top
J1  26.72,7.59 90 top
JP1  13.97,43.18 180 top
LED1  20.32,16.51 90 top
LED2  24.64,16.51 90 top
LSM1  47.37,41.27 0 top
LSM1_HEADER  47.24,36.32 0 top
LSM2  47.32,29.34 0 top
LSM2_HEADER  47.24,24.69 0 top
LSM3  54.86,41.27 0 top
LSM3_HEADER  54.74,36.32 0 top
LSM4  54.86,29.34 0 top
LSM4_HEADER  54.74,24.69 0 top
MAX1  32.92,16.08 90 top
MAX2  32.97,7.11 90 top
MCP1700T-3302  15.24,20.07 90 top
R1  20.32,19.05 180 top
R2  24.64,19.05 180 top
R4  21.51,2.69 90 top
R5  21.31,8.76 270 top
R6  15.39,38.35 90 top
R7  17.42,38.35 90 top
R8  19.48,38.35 90 top
R9  21.59,38.35 90 top
R10  45.72,16.89 90 top
R11  45.72,5.59 90 top
R12  53.09,16.89 90 top
R13  53.09,5.59 90 top
R15  29.59,36.83 90 bottom
R16  31.75,36.8 90 bottom
R17  34.67,20.32 180 bottom
R18  34.54,25.27 180 bottom
RESET  5.33,29.21 0 top
STANDOFF1  40.64,43.18 0 top
STANDOFF2  2.54,43.18 0 top
STANDOFF3  40.64,2.54 0 top
U1  22.86,27.94 0 top
U$1  17.78,1.91 90 top
U$2  40.18,16.13 270 top
U$3  39.29,19.74 180 top
U$4  39.29,12.55 180 top
U$6  21.39,21.49 0 top
U$7  16,28.07 270 top
U$8  47.5,26.67 180 top
U$10  47.73,38.56 0 top
U$12  35.84,3.17 180 top
U$13  39.29,10.97 180 top
U$14  0.64,0.64 180 bottom
U$15  28.96,32.77 180 top
U$16  40.18,7.39 270 top
U$17  30.28,30.23 0 top
U$18  55.22,38.56 0 top
U$19  55.22,26.67 180 top
X1  3.56,20.95 90 top

### Tracks (layer width: path | path; a pad name or v marks a point on that pad's centre or on a via)
32KHZ  (via drill 0.33)
  Top 0.203: DS3231M.1 23.72,39.85 23.11,39.24 23.11,38.23 22.35,37.47 21.7,37.47 R9.1 | 21.99,37.34 R9.1 | v23.62,34.54 23.24,34.54 21.59,36.2 R9.1
  Top 0.254: U1.7 20.58,25.94 arc90 21.39,26.75 v21.39,27.99 | DS3231M.1 24.61,39.85
  Bottom 0.203: v21.39,27.99 21.39,32.31 v23.62,34.54
!SLEEP
  Top 0.178: A139_HALL1.P$5 44.83,8.64 44.58,8.51 44.58,6.99 45.09,6.6 45.7,6.6 R11.2
!SLEEP2
  Top 0.178: A139_HALL2.P$5 44.83,19.94 44.58,19.68 44.58,18.41 45.09,17.91 45.7,17.91 R10.2
!SLEEP3
  Top 0.178: A139_HALL3.P$5 52.17,19.94 51.89,19.66 51.89,18.47 52.48,17.88 53.08,17.88 R12.2
!SLEEP4
  Top 0.178: A139_HALL4.P$5 52.12,8.64 51.92,8.43 51.92,6.86 52.2,6.58 53.08,6.58 R13.2
AGND  (via drill 0.33)
  Top 0.203: MAX2.1 33.71,5.21 33.1,5.82 33.1,8.97 34.02,9.89 34.02,10.54 C21.1 | C21.1 34.02,10.72 34.02,10.8 | MAX1.1 35.75,13.96 C6.1 v36.75,12.52 | C21.1 v33.05,10.62 | U1.21 29.61,28.34 C23.2 31.68,27.77 v31.7,27.79
  Bottom 0.203: 36.98,12.55 36.96,12.52 v36.75,12.52 37.52,13.29 HALL1.2 HALL2.2 36.37,29.09 | v33.05,10.62 32.97,10.62 | GROUND_CON.2 36.37,29.09 | 31.7,28.19 v31.7,27.79 31.7,28.37 32.42,29.09 36.37,29.09
  pour Bottom (isolate 0.305): 43.18,0.46 33.02,0.46 33.02,21.62 32.92,21.62 31.52,23.01 31.55,23.01 31.55,25.6 24.54,25.6 24.54,34.29 31.75,34.29 31.75,30.18 43.18,30.18
AVCC
  Top 0.203: INDUCTOR.P$1 29.95,25.75 C23.1
  Top 0.254: 30.46,25.94 C23.1 | U1.18 30.47,25.94 C23.1 | 30.45,25.92 C23.1
BUTTON1
  Top 0.178: 9.52,38.79 BUTTON1.P$1
  Top 0.254: 9.52,38.79 12.29,38.79 12.62,38.46 12.62,34.01 13.13,33.5 18.79,33.5 U1.32
CS_MAX1  (via drill 0.33)
  Top 0.203: U1.12 22.46,24.49 22.73,24.77 25.91,24.77 v26.75,23.93 | v29.36,21.41 29.46,21.31 29.46,19.13 29.64,18.95 31.83,18.95 32.21,18.57 32.21,17.35 31.57,16.71 MAX1.6
  Bottom 0.203: v26.75,23.93 26.75,23.19 28.52,21.41 29.26,21.41
  Bottom 0.254: v29.36,21.41 29.26,21.41
CS_MAX2  (via drill 0.33)
  Top 0.203: U1.13 23.26,22.08 | v30.68,19.61 31.9,19.61 32.61,18.9 32.61,17.07 31.83,16.28 31.83,7.85 31.73,7.75 MAX2.6
  Top 0.254: 23.26,22.08 23.34,22.08 v23.5,21.92
  Bottom 0.203: v30.68,19.61 30.68,19.56 30.61,19.63
  Bottom 0.254: v23.5,21.92 25.91,21.92 28.04,19.79 28.07,19.79 28.22,19.63 30.61,19.63
CS_SD  (via drill 0.38)
  Top 0.203: U$1.CS2 16.71,9.71 | 17.53,12.95 21.72,12.95 22.45,13.69 22.45,17.09 23.01,17.65 24.31,17.65 24.61,17.96 24.61,20.02 24.13,20.5 24.13,22.99 | 24.13,23.58 U1.14
  Top 0.254: 16.71,9.71 15.04,9.71 v14.99,9.65 14.99,10.41 17.53,12.95 | 24.13,23.58 24.13,22.99
  Bottom 0.254: U$14.P$2_CS 10.07,12.79 13.21,9.65 v14.99,9.65
DTR
  Top 0.254: JP1.6 9.14,41.78 9.41,41.78 C5.1
GND  (via drill 0.33, 0.38, 0.38 pad 0.61)
  Top 0.178: v3.86,2.92 U$1.MNT3 | BUTTON1.S$1 9.92,34.15
  Top 0.203: 17.27,28.19 17.27,28.07 | 18.55,27.56 U1.5 | RESET.P$1 1.36,26.42 | 16.2,19.05 v17.53,19.05 | 18.38,17.4 LED1.C 19.02,16.76 17.4,16.76 17.02,16.38 17.02,15.24 17.9,14.36 U$1.MNT2 v20.19,14.36 v20.19,14.35 | U$1.MNT1 19.25,1.71 v20.07,0.89 | U$1.GND6 20.16,5.3 v20.19,5.33 | v23.62,14.35 23.62,16.48 LED2.C | DS3231M.5 27.58,36.04 27.56,36.07 | v27.69,38.48 27.3,38.1 27.3,36.32 27.56,36.07 | v27.56,35.31 27.56,36.07
  Top 0.254: 9.04,17.78 C2.- 9.17,18.44 9.78,19.05 16.2,19.05 MCP1700T-3302.1 | U$1.MNT4 3.81,14.71 3.81,19.43 X1.1 | 17.27,28.07 17.78,27.56 18.55,27.56 | 1.36,24.3 1.36,26.42 4.15,29.21 v5.33,29.21 10.16,29.21 11.51,30.56 | 11.51,30.56 11.72,30.56 11.72,29.84 | 11.72,29.84 11.72,29 C4.2 C3.2 | 11.72,29.84 11.85,29.97 13.97,29.97 14.35,29.59 14.35,28.57 14.86,28.07 17.14,28.07 17.27,28.19 17.27,28.57 17.84,29.14 U1.3 | v8.13,5.33 18.59,5.33 U$1.GND6 | U$1.MNT3 7.84,1.36 8.76,2.29 18.13,2.29 U$1.MNT1 | v20.07,0.89 19.94,0.89 | 18.38,17.4 18.38,17.43 v18.29,17.53 | JP1.2 20.07,43.31 JP1.1 22.1,43.05 24,44.96 29.21,44.96 I2C_HEADER.3 | 9.92,34.15 11.18,32.89 11.18,30.89 11.51,30.56
  Top 0.305: 9.78,19.05 4.19,19.05 X1.1 2.67,19.68 1.4,20.95 1.4,24.26 | C1.- 5.97,22.61 5.08,23.5 2.16,23.5 1.4,24.26 | 1.4,24.26 1.36,24.3
  Bottom 0.178: U$14.P$13 3.38,2.44 v3.86,2.92 | U$14.P$14 19.22,1.74 v20.07,0.89 | U$14.P$9 14.74,17.05 16.28,18.59 17.07,18.59 v17.53,19.05 | U$14.P$10 16.79,16.02 v18.29,17.53 | 36.37,31.87 ACCEL1.2 37.52,34.23 37.59,34.3 | 37.59,34.3 C9.1 37.52,35.11 ACCEL2.2 37.52,38.67 36.58,39.62 36.58,40.01 36.32,40.26 35.7,40.26 C20.1 35.57,40.13 33.15,40.13 32,38.99 | 32.64,34.42 37.47,34.42 37.59,34.3 | C7.2 26.68,35.93
  Bottom 0.203: CR1220_BATTERY.GND v5.33,29.21 | v17.53,19.05 v18.29,17.53 | v20.07,0.89 20.19,1.02 v20.19,5.33 20.19,10.54 20.45,10.79 | 20.45,10.79 24,10.79 J1.6 | 20.45,10.79 20.19,11.05 v20.19,14.35 v23.62,14.35 | 17.91,43.18 JP1.2 | GROUND_CON.1 36.37,31.87 | v27.69,38.48 27.84,38.48 28.32,38.96 | 26.68,35.93 26.93,35.93 v27.56,35.31
  Bottom 0.254: U$14.P$6_GND 5.67,7.79 v8.13,5.33 | 28.2,38.96 28.32,38.96 28.68,38.96 30.48,40.77 I2C_HEADER.3
  pour Bottom (isolate 0.305): 0,45.72 43.18,45.72 43.18,31.24 32.72,31.24 32.61,35.05 22.23,35.05 22.23,24.64 26.42,24.64 26.42,20.85 31.75,20.85 31.75,0 0,0
HALL1_!SLEEP
  Top 0.203: 34.54,26.98 34.54,29.08 34.47,29.08 31.5,32.05 31.5,33.53 31.17,33.86 26.47,33.86 25.65,33.05 U1.25
  Top 0.254: HALL1.3 35.52,25.99 34.54,26.98
HALL1_!SLEEP_IN
  Top 0.178: HALL1_HEADER.P$4 46.35,3.95 R11.1
HALL1_GND
  Top 0.178: 48.76,6.6 C14.2 | HALL1_HEADER.P$1 47.75,1.52 48.51,2.29 48.51,3.17 47.75,3.94 47.75,5.6 48.51,6.36 C14.2 | A139_HALL1.P$3_4 49.28,9.14 49.78,8.64 49.78,7.62 49.15,6.99 48.77,6.99 48.64,6.86 C14.2
HALL1_OUTPUT
  Top 0.254: U1.19 32.21,26.74 33.53,25.43 HALL1.4
  Bottom 0.254: HALL1.4 33.67,22.86 R17.1
HALL1_VCC
  Top 0.178: A139_HALL1.P$6 45.64,7.83 45.97,7.49 46.99,7.49 | 46.99,7.49 47.95,7.49 A139_HALL1.P$1 | 46.99,7.49 46.99,5.84 46.74,5.59 44.83,5.59 44.58,5.21 44.58,3.68 44.7,3.56 45.34,3.56 45.47,3.43 45.47,1.91 45.85,1.52 HALL1_HEADER.P$2 47.24,0.64 48.39,0.64 48.51,0.76 48.51,1.14 48.9,1.52 48.9,3.68 48.64,3.94 C14.1 48.65,4.69
HALL1_VOUT
  Top 0.178: HALL1_HEADER.P$3 47.37,3.17 47.37,6.6 47.75,7.11 48.13,7.11 48.64,7.62 49.28,7.62 49.4,7.87 49.4,8.38 49.28,8.64 A139_HALL1.P$2
HALL2_!SLEEP
  Top 0.203: 35.52,28.81 35.52,28.84 31.98,32.38 31.98,33.81 31.47,34.31 26.16,34.31 25.32,33.48
  Top 0.254: HALL2.3 35.52,28.81 | 25.32,33.48 24.87,33.02 U1.26
HALL2_!SLEEP_IN
  Top 0.178: HALL2_HEADER.P$4 46.35,15.26 R10.1
HALL2_GND
  Top 0.178: HALL2_HEADER.P$1 47.75,12.83 48.51,13.59 48.51,14.35 47.75,15.11 47.75,16.77 C19.2 48.9,17.92 48.9,18.16 49.78,19.05 49.78,19.81 49.16,20.44 A139_HALL2.P$3_4
HALL2_OUTPUT
  Top 0.254: U1.22 32.3,29.14 HALL2.4
  Bottom 0.254: HALL2.4 33.54,27.69 R18.1
HALL2_VCC
  Top 0.178: A139_HALL2.P$6 45.52,19.38 46.1,18.8 46.99,18.8 | 46.99,18.8 47.82,18.8 A139_HALL2.P$1 | 46.99,18.8 46.99,17.02 46.86,16.89 44.96,16.89 44.58,16.51 44.58,15.11 44.7,14.99 45.34,14.99 45.47,14.86 45.47,13.46 46.1,12.83 HALL2_HEADER.P$2 47.12,11.94 48.26,11.94 48.9,12.7 48.9,14.48 48.64,14.73 C19.1
HALL2_VOUT
  Top 0.178: A139_HALL2.P$2 49.15,19.94 49.4,19.68 49.4,19.18 49.15,18.92 48.51,18.92 48.01,18.41 47.5,18.41 47.37,18.29 47.37,14.35 HALL2_HEADER.P$3
HALL3_!SLEEP_IN
  Top 0.178: R12.1 53.09,15.77 53.72,15.14 HALL3_HEADER.P$4
HALL3_GND
  Top 0.178: A139_HALL3.P$3_4 56.5,20.44 57.12,19.86 57.12,18.97 56.29,18.19 56.29,17.97 C32.2 56.01,17.68 55.14,16.84 55.14,15.04 55.85,14.35 55.85,13.44 HALL3_HEADER.P$1
HALL3_VCC
  Top 0.178: A139_HALL3.P$6 52.88,19.36 53.47,18.77 54.56,18.77 | A139_HALL3.P$1 55.24,18.85 55.24,18.82 55.19,18.77 54.56,18.77 | C32.1 56.01,14.76 56.24,14.53 56.24,13.26 55.83,12.88 55.83,12.22 55.73,12.14 55.55,11.99 54.61,11.99 HALL3_HEADER.P$2 52.83,13.46 52.83,14.61 52.68,14.76 52.25,14.76 52.05,14.96 52.05,16.64 52.3,16.89 53.87,16.89 54.3,17.32 54.3,18.52 54.56,18.77
HALL3_VOUT
  Top 0.178: A139_HALL3.P$2 56.54,19.94 56.77,19.71 56.77,19.15 56.54,18.92 55.88,18.92 55.4,18.44 54.91,18.44 54.74,18.26 54.74,14.28 HALL3_HEADER.P$3
HALL4_!SLEEP_IN
  Top 0.178: R13.1 53.09,4.34 53.7,3.73 53.7,2.82 HALL4_HEADER.P$4
HALL4_GND
  Top 0.178: HALL4_HEADER.P$1 55.88,2.41 55.88,3.25 55.12,4.01 55.12,5.71 55.76,6.36 C33.2 56.01,6.88 56.13,7.01 56.39,7.01 57.1,7.72 57.1,8.66 56.62,9.14 A139_HALL4.P$3_4
HALL4_VCC
  Top 0.178: A139_HALL4.P$6 52.88,7.85 53.26,7.47 55.16,7.47 A139_HALL4.P$1 55.81,8.14 55.17,7.49 54.66,7.49 54.36,7.19 54.36,5.84 54.1,5.59 52.2,5.59 51.94,5.33 51.94,3.94 52.2,3.68 52.68,3.68 52.91,3.45 52.91,2.34 HALL4_HEADER.P$2 54.48,0.74 55.75,0.74 55.91,0.91 55.91,1.75 56.26,2.11 56.26,3.61 56.01,3.86 C33.1
HALL4_VOUT
  Top 0.178: A139_HALL4.P$2 56.57,8.64 56.72,8.48 56.72,7.9 56.52,7.7 55.91,7.7 55.35,7.14 55.09,7.14 54.74,6.78 54.74,3.05 HALL4_HEADER.P$3
LED_GRN
  Top 0.203: 20.86,22.89 20.19,22.23 20.19,20.7 20.7,20.19 23.26,20.19 23.64,19.81 R2.2
  Top 0.254: U1.10 20.86,22.89
LED_RED
  Top 0.254: U1.9 20.06,23.49 19.43,22.86 19.43,19.16 R1.2
LSM1_GND  (via drill 0.33)
  Top 0.178: 46.81,42.73 46.23,43.18 v45.72,43.18 | v45.47,38.73 45.92,39.19 LSM1.P$5 | v48.77,44.32 49.4,44.01 49.4,42.32 49.35,42.27 LSM1.P$13 | LSM1.P$10 49.28,40.77 49.51,41 49.51,41.55 49.28,41.78 48.83,41.78 | 48.83,41.78 LSM1.P$12 | 48.83,41.78 LSM1.P$13 | LSM1.P$13 | U$10.1 46.97,37.87 LSM1_HEADER.P$2
  Top 0.203: LSM1.P$16 46.81,42.73
  Bottom 0.178: C11.2 45.71,43.56 | 45.71,43.56 45.71,43.45 | 46.61,43.05 46.99,42.67 46.99,39.88 46.61,39.62 45.98,39.62 arc90 45.72,39.37 45.72,38.99 v45.47,38.73 | 45.71,43.56 45.72,43.32 v45.72,43.18 45.85,43.05 46.61,43.05 | 46.61,43.05 47.12,43.05 47.8,43.41 48.01,43.56 48.36,43.92 48.56,44.25 v48.77,44.32 49.4,43.99 49.4,42.6 48.98,42.17 C12.2 | C13.2 46.47,38.37 LSM1_HEADER.P$2
  Bottom 0.203: v45.47,38.73 C13.2
LSM1_SCL
  Top 0.178: LSM1_HEADER.P$3 46.48,35.69 45.72,36.45 45.72,37.9 44.83,38.23 44.83,39.12 45.21,39.5 45.21,40.64 45.34,40.77 LSM1.P$4
LSM1_SDA
  Top 0.178: LSM1.P$6 46.87,39.48 46.71,39.32 46.33,39.32 46.25,39.24 46.25,37.31 LSM1_HEADER.P$1
LSM1_SDO
  Top 0.178: LSM1.P$7 47.37,39.45 47.73,38.99 U$10.2
LSM1_VDD  (via drill 0.33)
  Top 0.178: LSM1.P$1 45.48,42.27 45.09,42.67 45.09,43.81 45.59,44.32 47.24,44.32 47.88,43.69 LSM1.P$14 47.87,43.3 48.01,43.43 v48.77,43.43 | LSM1.P$8 47.87,39.76 48.26,39.37 48.97,39.37 49.28,39.06 v49.28,38.61 49.1,38.56 U$10.3
  Bottom 0.178: v48.77,43.43 47.9,42.82 arc55 47.8,42.63 47.8,41.24 arc51 47.92,40.99 C12.1 49.28,39.78 v49.28,38.61 49.11,38.55 48.27,38.55 | LSM1_HEADER.P$4 48.23,35.69 48.72,36.17 48.72,38.1 48.27,38.55 | C13.1 48.27,38.55
LSM2_GND  (via drill 0.33)
  Top 0.178: v45.47,26.8 45.47,27.93 LSM2.P$5 | v48.77,32.26 49.4,31.75 49.4,30.45 49.28,30.34 LSM2.P$13 LSM2.P$12 49.34,29.84 49.45,29.72 49.45,28.98 49.3,28.83 LSM2.P$10 | v45.85,31.24 46.35,31.24 LSM2.P$16 | U$8.3 46.58,26.44 LSM2_HEADER.P$2
  Bottom 0.178: 46.99,30.99 46.1,30.99 v45.85,31.24 45.84,31.36 C16.2 | 46.99,30.99 46.99,27.81 46.86,27.69 45.85,27.69 45.47,27.3 v45.47,26.8 C18.2 46.47,26.55 LSM2_HEADER.P$2 | 46.99,30.99 48.01,31.62 48.13,31.62 v48.77,32.26 49.4,31.75 49.4,30.79 | 49.4,30.68 49.4,30.79 | C17.2 48.85,30.24 49.4,30.79
LSM2_SCL
  Top 0.178: LSM2_HEADER.P$3 46.2,24.05 45.72,24.56 45.72,25.88 44.83,26.42 44.83,27.18 45.09,27.43 45.09,28.57 45.34,28.83 45.72,28.83 | 45.72,28.83 45.91,28.83 | LSM2.P$4 45.73,28.84 45.72,28.83
LSM2_SDA
  Top 0.178: LSM2.P$6 46.82,27.41 46.26,27.41 46.08,27.15 46.08,25.7 LSM2_HEADER.P$1
LSM2_SDO
  Top 0.178: LSM2.P$7 47.32,27.3 47.5,27.13 U$8.2
LSM2_VDD  (via drill 0.33)
  Top 0.178: 45.72,30.35 45.47,30.35 45.09,30.86 45.09,31.5 45.97,32.38 47.12,32.38 47.88,31.62 47.88,31.37 | 45.72,30.35 45.91,30.35 | 47.88,31.37 47.88,30.8 LSM2.P$14 | v48.77,31.37 47.88,31.37 | LSM2.P$8 48.11,27.4 48.28,27.41 48.92,27.4 49.2,27.13 v49.2,26.8 48.62,26.8 U$8.1 | LSM2.P$1 45.74,30.34 45.72,30.35
  Bottom 0.178: 48.39,28.45 48.91,28.45 C17.1 | v48.77,31.37 48.64,31.24 48.26,31.24 47.68,30.89 47.7,28.93 47.7,28.7 47.95,28.45 C17.1 | LSM2_HEADER.P$4 48.31,24.05 48.72,24.51 48.72,26.35 C18.1 v49.2,26.8 49.2,27.33 48.67,27.91 48.67,28.41 C17.1 | 48.67,28.39 C17.1 | 48.81,28.55 C17.1
LSM3_GND  (via drill 0.33)
  Top 0.178: U$18.1 54.46,37.87 LSM3_HEADER.P$2 | LSM3.P$5 53.42,39.34 53.16,39.09 53.16,38.86 v53.03,38.73 | v53.34,43.2 53.88,43.2 LSM3.P$16 | LSM3.P$10 56.88,40.77 57,40.87 57,41.68 56.87,41.78 56.32,41.78 LSM3.P$12 LSM3.P$13 56.8,42.27 56.87,42.34 56.87,43.84 v56.26,44.45
  Bottom 0.178: LSM3_HEADER.P$2 53.96,38.37 C27.2 v53.03,38.73 53.03,39.29 53.37,39.62 54.25,39.62 54.56,39.93 54.56,42.67 54.1,43.13 | C25.2 53.2,43.34 v53.34,43.2 53.42,43.13 53.44,43.13 | 54.1,43.13 55.09,43.13 55.5,43.54 55.5,43.56 56.26,44.32 v56.26,44.45 56.87,43.84 56.87,42.39 56.65,42.17 C26.2 | 53.37,43.2 53.44,43.13 | 53.44,43.13 54.1,43.13
LSM3_SCL
  Top 0.178: LSM3.P$4 52.94,40.77 52.73,40.62 52.73,39.37 52.35,38.99 52.35,38.48 53.24,37.59 53.24,36.55 LSM3_HEADER.P$3
LSM3_SDA
  Top 0.178: LSM3.P$6 54.36,39.38 54.25,39.27 53.87,39.27 53.77,39.17 53.77,37.29 LSM3_HEADER.P$1
LSM3_SDO
  Top 0.178: LSM3.P$7 54.86,39.37 55.19,39.04 55.19,38.58 U$18.2
LSM3_VDD  (via drill 0.33)
  Top 0.178: LSM3.P$14 55.36,43.23 | 55.36,43.23 55.36,43.8 54.71,44.45 53.34,44.45 52.7,43.81 52.7,42.6 53.01,42.29 53.4,42.29 LSM3.P$1 | v56.24,43.43 55.57,43.43 55.36,43.23 | LSM3.P$8 55.36,39.76 55.75,39.37 56.52,39.37 56.77,39.12 v56.77,38.58 56.74,38.56 U$18.3
  Bottom 0.178: 55.92,40.38 55.3,41 55.3,42.62 v56.24,43.43 | 55.92,40.38 C26.1 | LSM3_HEADER.P$4 55.63,35.69 56.24,36.3 56.24,37.77 55.76,38.24 C27.1 56.62,38.73 v56.77,38.58 56.77,39.12 55.92,39.97 55.92,40.38
LSM4_GND  (via drill 0.33)
  Top 0.178: U$19.3 54.46,26.24 LSM4_HEADER.P$2 | LSM4.P$10 56.88,28.84 57,28.96 57,29.74 56.9,29.84 56.32,29.84 LSM4.P$12 LSM4.P$13 56.88,30.34 56.95,30.4 56.95,31.8 v56.34,32.41 | LSM4.P$16 54.36,30.8 53.92,31.24 v53.39,31.24 | LSM4.P$5 53.41,28.32 53.01,27.91 v53.01,26.8
  Bottom 0.178: LSM4_HEADER.P$2 53.96,26.73 C31.2 53.03,26.8 | C29.2 53.29,32.5 53.29,31.34 v53.39,31.24 53.44,31.19 54.36,31.19 | 54.36,31.19 54.69,31.19 55.14,31.65 55.65,31.65 56.29,32.28 v56.34,32.41 56.95,31.8 56.95,30.86 56.32,30.24 C30.2 | v53.01,26.8 53.03,26.8 | 53.03,26.8 53.03,27.53 53.16,27.66 54.33,27.66 54.53,27.86 54.53,31.01 54.36,31.19
LSM4_SCL
  Top 0.178: LSM4_HEADER.P$3 53.49,24.05 53.24,24.31 53.24,25.6 52.43,26.42 52.43,27.36 52.68,27.61 52.68,28.63 52.88,28.83 LSM4.P$4
LSM4_SDA
  Top 0.178: LSM4.P$6 54.36,27.46 54.3,27.41 53.92,27.41 53.67,27.15 53.67,25.76 LSM4_HEADER.P$1
LSM4_SDO
  Top 0.178: LSM4.P$7 54.86,27.41 55.22,27.05 U$19.2
LSM4_VDD  (via drill 0.33)
  Top 0.178: U$19.1 56.03,26.72 v56.82,26.72 56.84,26.75 56.84,27.33 56.74,27.43 55.65,27.43 55.36,27.72 LSM4.P$8 | LSM4.P$1 53.15,30.34 52.76,30.73 52.76,31.95 53.19,32.38 54.99,32.38 55.37,32 55.37,31.42 | 55.37,31.42 55.37,30.8 LSM4.P$14 55.36,31.41 55.37,31.42 | 55.37,31.42 v56.31,31.42
  Bottom 0.178: C31.1 55.76,26.66 | 55.76,26.66 56.24,26.19 56.24,24.31 55.98,24.05 LSM4_HEADER.P$4 | 55.76,26.66 56.76,26.66 v56.82,26.72 56.84,26.75 56.84,27.38 56.24,27.99 C30.1 56.2,28.47 55.68,28.47 55.24,28.91 55.24,30.84 55.68,31.27 56.19,31.27 56.31,31.39 v56.31,31.42
MISO  (via drill 0.33, 0.38)
  Top 0.203: 22.73,2.67 20.45,2.67 20.19,2.92 20.19,3.94 19.94,4.19 | v25.25,11.58 25.25,13.18 27.05,14.99 27.05,20.07 25.68,21.44 25.68,23.63 U1.16 | v28.04,12.8 28.07,12.78 28.07,14.45 28.57,14.96 30.15,14.96 MAX1.7 | MAX2.7 28.14,6.48 J1.1
  Top 0.254: J1.1 26.67,5.08 25.4,3.81 23.88,3.81 22.73,2.67 | 19.94,4.19 18.63,4.19 U$1.MISO7
  Top 0.305: U$1.MISO7 8.27,4.21 v8.13,4.19
  Bottom 0.203: J1.1 26.7,5.05 25.43,6.33 25.43,8.89 | 25.43,8.89 25.43,11.4 v25.25,11.58 | v28.04,12.8 28.04,11.05 28.19,10.9 28.19,9.32 27.74,8.87 25.45,8.87 25.43,8.89
  Bottom 0.305: v8.13,4.19 4.57,7.87 U$14.P$7_MISO
MOSI  (via drill 0.38)
  Top 0.203: J1.4 23.88,7.62 22.73,8.76 | 22.73,8.76 18.78,8.76 U$1.MOSI3 | 24.89,23.61 24.89,21.59 26.59,19.89 26.59,15.19 22.73,11.33 22.73,8.76
  Top 0.254: 24.89,23.61 U1.15
  Top 0.305: U$1.MOSI3 15.02,8.61 v14.99,8.64
  Bottom 0.305: v14.99,8.64 13.08,8.64 8.89,12.83 8.89,17.15 U$14.P$3_MOSI
N$1
  Top 0.203: 40.19,14.85 U$2.P$2 | 40.19,13.81 40.34,13.51 40.34,12.69 U$4.1
  Top 1.016: 40.19,14.85 40.19,13.81
N$2
  Top 0.203: R1.1 21.32,16.56 LED1.A
N$3
  Top 0.203: 40.19,17.41 U$2.P$1 | 40.19,18.5 40.36,18.67 40.36,19.57 U$3.1
  Top 1.016: 40.19,17.41 40.19,18.5
N$4  (via drill 0.33)
  Top 0.178: v46.63,43.69 46.97,43.69 47.37,43.28 LSM1.P$15
  Bottom 0.178: C11.1 47.3,44.45 v46.63,43.69
N$5  (via drill 0.33)
  Top 0.178: LSM1.P$2 45.09,41.77 v44.83,42.04
  Bottom 0.178: 45.71,42.04 v44.83,42.04
  Bottom 0.203: 45.71,42.04 C10.2
N$6
  Top 0.203: U1.23 27.86,29.94 28.93,31.01 28.93,31.47 U$15.1
  Bottom 0.203: U$15.1 31.75,34.29
  Bottom 0.254: R16.1 31.75,34.29
N$7  (via drill 0.33)
  Top 0.203: U1.20 v28.43,27.54
  Bottom 0.203: v28.43,27.54 28.43,28.38 U$17.1
N$8
  Bottom 0.178: 55.78,38.66 55.78,38.76
N$9
  Top 0.203: U1.24 27.15,32.23 U$15.2
  Bottom 0.254: R15.1 29.59,34.67 U$15.2
N$10
  Top 0.203: LED2.A 25.69,19 R2.1
N$11
  Top 0.178: U$12.1 37.52,3.68
  Top 0.203: 40.17,6.08 U$16.P$2 | 38.39,4.97 38.41,4.83
  Top 0.406: 38.39,5.85 38.39,4.97 | 37.52,3.68 38.41,4.83
  Top 1.016: 38.39,5.85 38.66,6.12 U$16.P$2
N$12
  Top 0.203: 40.22,8.67 U$16.P$1 | 40.22,9.77 40.08,9.91 40.08,10.86 U$13.1
  Top 1.016: 40.22,8.67 40.22,9.77
N$14  (via drill 0.33)
  Top 0.178: v52.35,42.09 52.65,41.78 53.41,41.78 LSM3.P$2
  Bottom 0.178: C24.2 52.44,42.17 v52.35,42.09
N$15  (via drill 0.33)
  Top 0.178: LSM3.P$3 52.43,41.27 v52.38,41.22
  Bottom 0.178: v52.38,41.22 52.38,40.56 52.58,40.36 53.58,40.36 C24.1
N$17  (via drill 0.33)
  Top 0.178: LSM1.P$3 44.96,41.27 v44.83,41.15
  Bottom 0.178: v44.83,41.15 44.83,40.64 45.09,40.39 C10.1
N$18  (via drill 0.33)
  Top 0.178: LSM2.P$2 45.09,29.84 v44.86,30.07
  Bottom 0.178: v44.86,30.07 44.91,30.07 45.06,30.23 46.09,30.23 C15.2
N$19  (via drill 0.33)
  Top 0.178: LSM2.P$3 45.01,29.34 v44.88,29.21
  Bottom 0.178: v44.88,29.21 44.88,28.68 45.14,28.42 46.09,28.42 C15.1
N$20  (via drill 0.33)
  Top 0.178: LSM2.P$15 47.32,31.34 v46.74,31.75
  Bottom 0.178: v46.74,31.75 46.74,31.8 47.07,32.18 47.31,32.18 C16.1
N$21  (via drill 0.33)
  Top 0.178: v54.1,43.84 54.38,43.84 54.86,43.36 LSM3.P$15
  Bottom 0.178: C25.1 54.71,44.45 v54.1,43.84
N$22  (via drill 0.33)
  Top 0.178: LSM4.P$3 52.32,29.34 v52.25,29.26
  Bottom 0.178: v52.25,29.26 52.25,28.73 52.55,28.42 53.5,28.42 C28.1
N$23  (via drill 0.33)
  Top 0.178: v52.25,30.23 52.25,30.15 52.55,29.84 LSM4.P$2
  Bottom 0.178: C28.2 v52.26,30.24 v52.25,30.23
N$24  (via drill 0.33)
  Top 0.178: v54.2,31.77 54.43,31.77 54.86,31.34 LSM4.P$15
  Bottom 0.178: C29.1 54.94,32.51 v54.2,31.77
NC1  (via drill 0.38)
  Top 0.203: R5.1 20.84,9.76 19.81,10.79 U$1.NC1
  Top 0.254: U$1.NC1 v17.02,10.79
  Bottom 0.254: v17.02,10.79 13.59,10.79 11.18,13.21 U$14.P$1_RSV
PD3
  Top 0.254: U$7.1 17.79,30.74 U1.1
PD7
  Top 0.178: U$6.1 21.39,22.38 21.64,22.63 21.64,23.63 U1.11
RES  (via drill 0.33)
  Top 0.254: U1.2 v20.48,29.94 | v22.91,35.84 v22.91,37.13
  Bottom 0.203: 24.23,43.69 24.13,43.69 22.86,42.42 22.86,37.19 v22.91,37.13 | 20.48,34.68 20.48,35.34 20.95,35.81 22.89,35.81 v22.91,35.84
  Bottom 0.254: U$7.2 18.29,26.8 20.57,29.08 20.57,29.84 v20.48,29.94 20.48,34.68 | 24.23,43.69 I2C_HEADER.1
RES8  (via drill 0.38)
  Top 0.203: 20.56,1.67 19.81,2.41 19.81,2.79 19.56,3.05
  Top 0.254: R4.1 20.56,1.67 | 19.56,3.05 18.68,3.05 U$1.RES8
  Top 0.305: v8.13,3.05 18.56,3.05 U$1.RES8
  Bottom 0.305: U$14.P$8_RSV 3.48,7.7 v8.13,3.05
RESET  (via drill 0.33, 0.38 pad 0.61)
  Top 0.203: v22.48,30.63 22.48,32.21 U1.29 22.48,32.25 22.48,33.02 21.59,33.91 20.22,33.91 19.02,35.23 16.34,35.23 15.63,35.94 | 15.63,35.94 15.62,35.95 15.62,37.25 | 15.63,35.94 14.73,35.94 v14.35,36.32
  Top 0.254: RESET.S$1 4.66,31.46 4.66,32.73 9.27,37.34 10.16,37.34 10.74,37.92 11.47,37.92 C5.2 11.48,37.24 v11.51,37.01 | 15.62,37.25 R6.1
  Bottom 0.203: v22.48,30.63 22.48,27.81 | 26.8,11.05 26.8,10.21 J1.5 | 13.16,37.01 13.66,37.01 v14.35,36.32
  Bottom 0.254: v11.51,37.01 13.16,37.01 | 26.8,11.05 26.8,11.3 25.25,12.85 25.25,15.62 22.53,18.34 22.53,24.61 23.19,25.27 23.19,26.34 22.48,27.05 22.48,27.81
SCK  (via drill 0.38)
  Top 0.203: U$1.SCK5 18.68,6.35 20.45,6.35 20.95,5.84 22.99,5.84 23.5,6.35 25.48,6.35 J1.3 28.55,7.59 28.55,8.89 | U1.17 27.18,25.11 27.18,24.64 27.51,24.31 27.51,17.78 | 27.51,17.78 27.51,14.76 26.14,13.39 26.14,12.9 28.55,10.49 28.55,8.89 | MAX1.5 27.71,17.98 27.51,17.78 | MAX2.5 28.68,9.02 28.55,8.89
  Top 0.305: U$1.SCK5 8.33,6.41 v8.13,6.48
  Bottom 0.305: v8.13,6.48 6.73,8 6.73,17.19 U$14.P$5_SCK
SCL
  Top 0.178: 35.52,43.65 ACCEL2.3 ACCEL1.3
  Top 0.203: U1.28 23.26,33.13 22.1,34.29 20.7,34.29 19.23,35.76 18.44,35.76 17.42,36.78 | I2C_HEADER.5 34.42,44.83 32.51,44.83 31.75,44.07 31.75,43.31 29.84,41.4 29.84,39.88 DS3231M.8 | 23.11,40.59 22.61,40.08 22.61,38.61 22.38,38.38 18.45,38.38 R7.1
  Top 0.254: 17.42,36.78 R7.1 | DS3231M.8 27.03,39.85 26.29,40.59 23.11,40.59 | 35.52,43.65 I2C_HEADER.5
SDA
  Top 0.178: 33.52,42.93 ACCEL2.4 ACCEL1.4
  Top 0.203: 24.06,33.15 24.06,33.46 26.54,35.94 26.54,38.1 27.05,38.61 27.05,39.12 27.18,39.24 28.19,39.24 28.85,38.58 DS3231M.7
  Top 0.254: U1.27 24.06,33.09 | 24.06,33.09 22.4,34.75 21.01,34.75 19.48,36.27 R8.1 | 24.06,33.09 24.06,33.15 | 33.52,42.93 I2C_HEADER.4 | DS3231M.7 32.41,38.58 ACCEL2.4
T+_MAX1  (via drill 0.33)
  Top 0.203: v33.86,16.71 MAX1.3 36.91,16.71 | 38.39,19.37 U$3.2 38.41,19.73 38.41,18.85
  Top 0.406: 36.91,16.71 37.29,17.09 37.29,17.73 38.41,18.85
  Bottom 0.203: v33.86,16.71 34.99,16.71 C8.2
T+_MAX2  (via drill 0.33)
  Top 0.203: v33.71,7.75 MAX2.3 36.93,7.75 | 38.42,10.66 U$13.2 38.41,10.96 38.41,10.01
  Top 0.406: 36.93,7.75 37.36,8.18 37.36,8.97 38.41,10.01
  Bottom 0.203: v33.71,7.75 34.86,7.75 C22.2
T-_MAX1  (via drill 0.33)
  Top 0.203: v33.83,15.44 MAX1.2 36.91,15.44 | 38.32,12.96 U$4.2 38.41,12.56 38.41,13.44
  Top 0.406: 38.41,13.44 37.85,13.99 37.85,14.43 36.91,15.44
  Bottom 0.203: v33.83,15.44 34.79,15.44 C8.1
T-_MAX2  (via drill 0.33)
  Top 0.178: 35.05,4.06 35.05,3.29 U$12.2
  Top 0.203: v33.71,6.48 MAX2.2 36.93,6.48
  Top 0.305: 37.26,4.43 35.42,4.43 35.05,4.06
  Top 0.406: 37.26,4.43 37.26,5.92 36.93,6.48
  Bottom 0.203: v33.71,6.48 34.86,6.48 C22.1
TO_FTDI_RX
  Top 0.203: U1.31 20.86,32.99 20.7,33.15 19.81,33.15 18.8,34.16 17.53,34.16
  Top 0.254: JP1.5 13.21,40.01 13.21,34.54 13.59,34.16 17.53,34.16
TO_FTDI_TX
  Top 0.203: U1.30 21.66,33.08 21.21,33.53 20.07,33.53 18.92,34.67 17.65,34.67 14.1,34.67
  Top 0.254: JP1.4 13.69,42.32 13.69,35.08 14.1,34.67
VBAT  (via drill 0.33)
  Top 0.178: 28.65,37.29 28.47,37.29 v28.09,36.78
  Top 0.254: 28.65,37.29 DS3231M.6
  Bottom 0.178: 26.36,36.83 27.18,36.8 v28.09,36.78
  Bottom 0.203: 26.36,36.83 24.26,36.83 23.88,36.45 22.48,36.45 22.33,36.3 20.73,36.3 19.61,35.18 12.06,35.18 10.95,36.3 10.92,36.3
  Bottom 0.254: CR1220_BATTERY.P$1 10.54,38.23 10.54,36.68 10.92,36.3
  Bottom 0.406: CR1220_BATTERY.P$2 8.89,22.1 11.81,25.02 11.81,33.91 CR1220_BATTERY.P$1
VCC  (via drill 0.33, 0.38, 0.38 pad 0.61)
  Top 0.203: U1.6 19.37,26.74 | 19.43,28.32 18.59,28.32 U1.4 | MAX1.4 33.66,17.98 | 33.66,17.98 33.12,17.45 33.12,13.43 C6.2 | 34.29,21.59 33.1,20.4 33.1,18.54 33.66,17.98 | 34.29,21.59 38.26,21.59 HALL1.1 | v28.25,23.65 28.79,22.98 INDUCTOR.P$2 31.58,22.98 32.94,21.61 34.27,21.61 34.29,21.59 | R9.2 R8.2 | R6.2 15.39,42.9 JP1.3 | DS3231M.2 25.96,38.58 v26.19,38.81
  Top 0.254: J1.2 23,5.08 | 23,5.08 R4.2 | 23,5.08 v21.59,5.08 | v21.59,6.48 R5.2 | R6.2 R7.2 R8.2 20.24,40.08 21.49,41.33 26.59,41.33 27.94,42.67 I2C_HEADER.2 | 13.35,26.79 C3.1 C4.1 | 16.01,25.53 16.28,25.26 16.37,25.26 16.38,25.27 | 17.78,26.67 18.5,26.67 U1.6 | 16.51,12.83 13.84,10.16 13.84,8.51 14.86,7.49 v14.99,7.49 18.61,7.49 U$1.VDD4 | HALL1.1 HALL2.1 ACCEL1.1 ACCEL2.1 38.26,38.73 v36.45,38.73 | v22.35,25.91 v23.93,25.91
  Top 0.305: C2.+ 16.51,17.65 | 16.51,17.65 16.51,12.83 | 19.37,26.74 19.68,27.05 | 19.68,27.05 19.68,28.07 19.43,28.32 | 16.28,25.26 MCP1700T-3302.2 18.29,19.51 18.29,18.54 17.4,17.91 16.51,17.65 | 19.68,27.05 v20.45,27.05 | 13.35,26.79 14.61,25.53 16.01,25.53 | 16.38,25.27 17.78,26.67 | U$1.VDD4 21.33,7.5 R5.2 | C6.2 33.95,12.42 C21.2 35.59,10.45 MAX2.4
  Bottom 0.178: R15.2 29.07,37.83 28.97,37.73 C7.1 | C20.2 37.48,40.15 39.51,38.12 ACCEL2.1 39.76,37.23 C9.2
  Bottom 0.203: C7.1 26.26,38.48 v26.19,38.81 26.19,41.68 I2C_HEADER.2
  Bottom 0.254: v21.59,5.08 v21.59,6.48 | U$14.P$4_VDD 7.88,12.57 12.95,7.49 v14.99,7.49 | v23.93,25.91 25.98,25.91 v28.25,23.65 | R15.2 29.62,37.8 R16.2 32.22,37.8 33.15,38.73 v36.45,38.73
  Bottom 0.305: v20.45,27.05 21.21,27.05 v22.35,25.91
VRAW
  Top 0.254: C1.+ 12.67,21.59
  Top 0.305: 12.67,21.59 MCP1700T-3302.3
  Top 0.406: C1.+ 10.39,20.32 6.22,20.32 4.32,22.23 X1.2

### Text on the board
tPlace: ACCEL2 | ACCEL2
bPlace: 100kΩ | 100kΩ
tNames: FTDI HEADER 3.3V ONLY! | I2C HEADER | LSM303D | LSM303D | Read | 0x3B | 0x3A | Write | 0x3B | Read | Write | 0x3A | GND | BLACK | RES | VCC | GND | SDA | SCL | GREEN | DTR | RX | TX | VCC | GND | SENSORS | ACCEL1 | ACCEL1 | 0.1µF | SA0 | SA0 | SDA | GND | SDA | GND | 10k Ω | SCL | VDD | SCL | VDD | Mussel / Tracker2 / RevC | A1 | A0 | 2016 | Read | LSM303D | LSM303D | LP MILLER | ARef | 0x3D | Write | 0x3C | 0x3D | Read | Write | 0x3C | PD3 | 0.1µF | SA0 | SA0 | PD4 | 0.1µF | SDA | GND | SDA | GND | POWER | SCL | + | SCL | VDD | VDD | PD7 | THERMOCOUPLES | FERRITE | VREG | - | + | TC1 | 100 Ω | 100 Ω | ERROR | GREEN | VOUT | VOUT | MAX31855K | SLEEP | SLEEP | GND | RST | - | FERRITE | FERRITE | VCC | GND | VCC | GND | 0.1µF | + | New Molex / microSD / 502774-0891 | 100k Ω | VCC | MAX31855K | - | MISO | TC2 | ICSP / HEADER | FERRITE | SLEEP | VOUT | SLEEP | VOUT | 100k Ω | VCC | VCC | GND | VCC | GND
bNames: DTR | RX | TX | VCC | GND | GND | RES | VCC | GND | SDA | 0.1µF | SCL | ACCEL1 | ACCEL1 | Holes / <-1.5"-> | OPTIONAL | Bridge / resistors | Holes / <-1.6"-> | SCL | SDA | GND | SDA | 0.1µF | GND | SDA | SCL | VDD | SCL | VDD | A1 | A0 | ARef | HALL / EFFECT | GND | VCC | PD3 | A7 | SLEEP | CR1220 | PD4 | HALL / EFFECT | GND | VCC | SDA | GND | SDA | GND | A6 | SLEEP | SCL | POWER | SCL | VDD | VDD | + | PD7 | GND | VCC | A139x / HALL / SENSOR | A139x / HALL / SENSOR | - | 0.01µF | T+ | T- | VOUT | VOUT | SLEEP | SLEEP | OLD MOLEX / microSD | VCC | GND | VCC | GND | GND | RST | SCK | 0.01µF | THERMOCOUPLES | T+ | A139x / HALL / SENSOR | A139x / HALL / SENSOR | MOSI | VCC | MISO | T- | SLEEP | VOUT | SLEEP | VOUT | VCC | GND | VCC | GND